# Altium project NXP_FRDM_IMX93.PrjPcb (part 1 of 13)
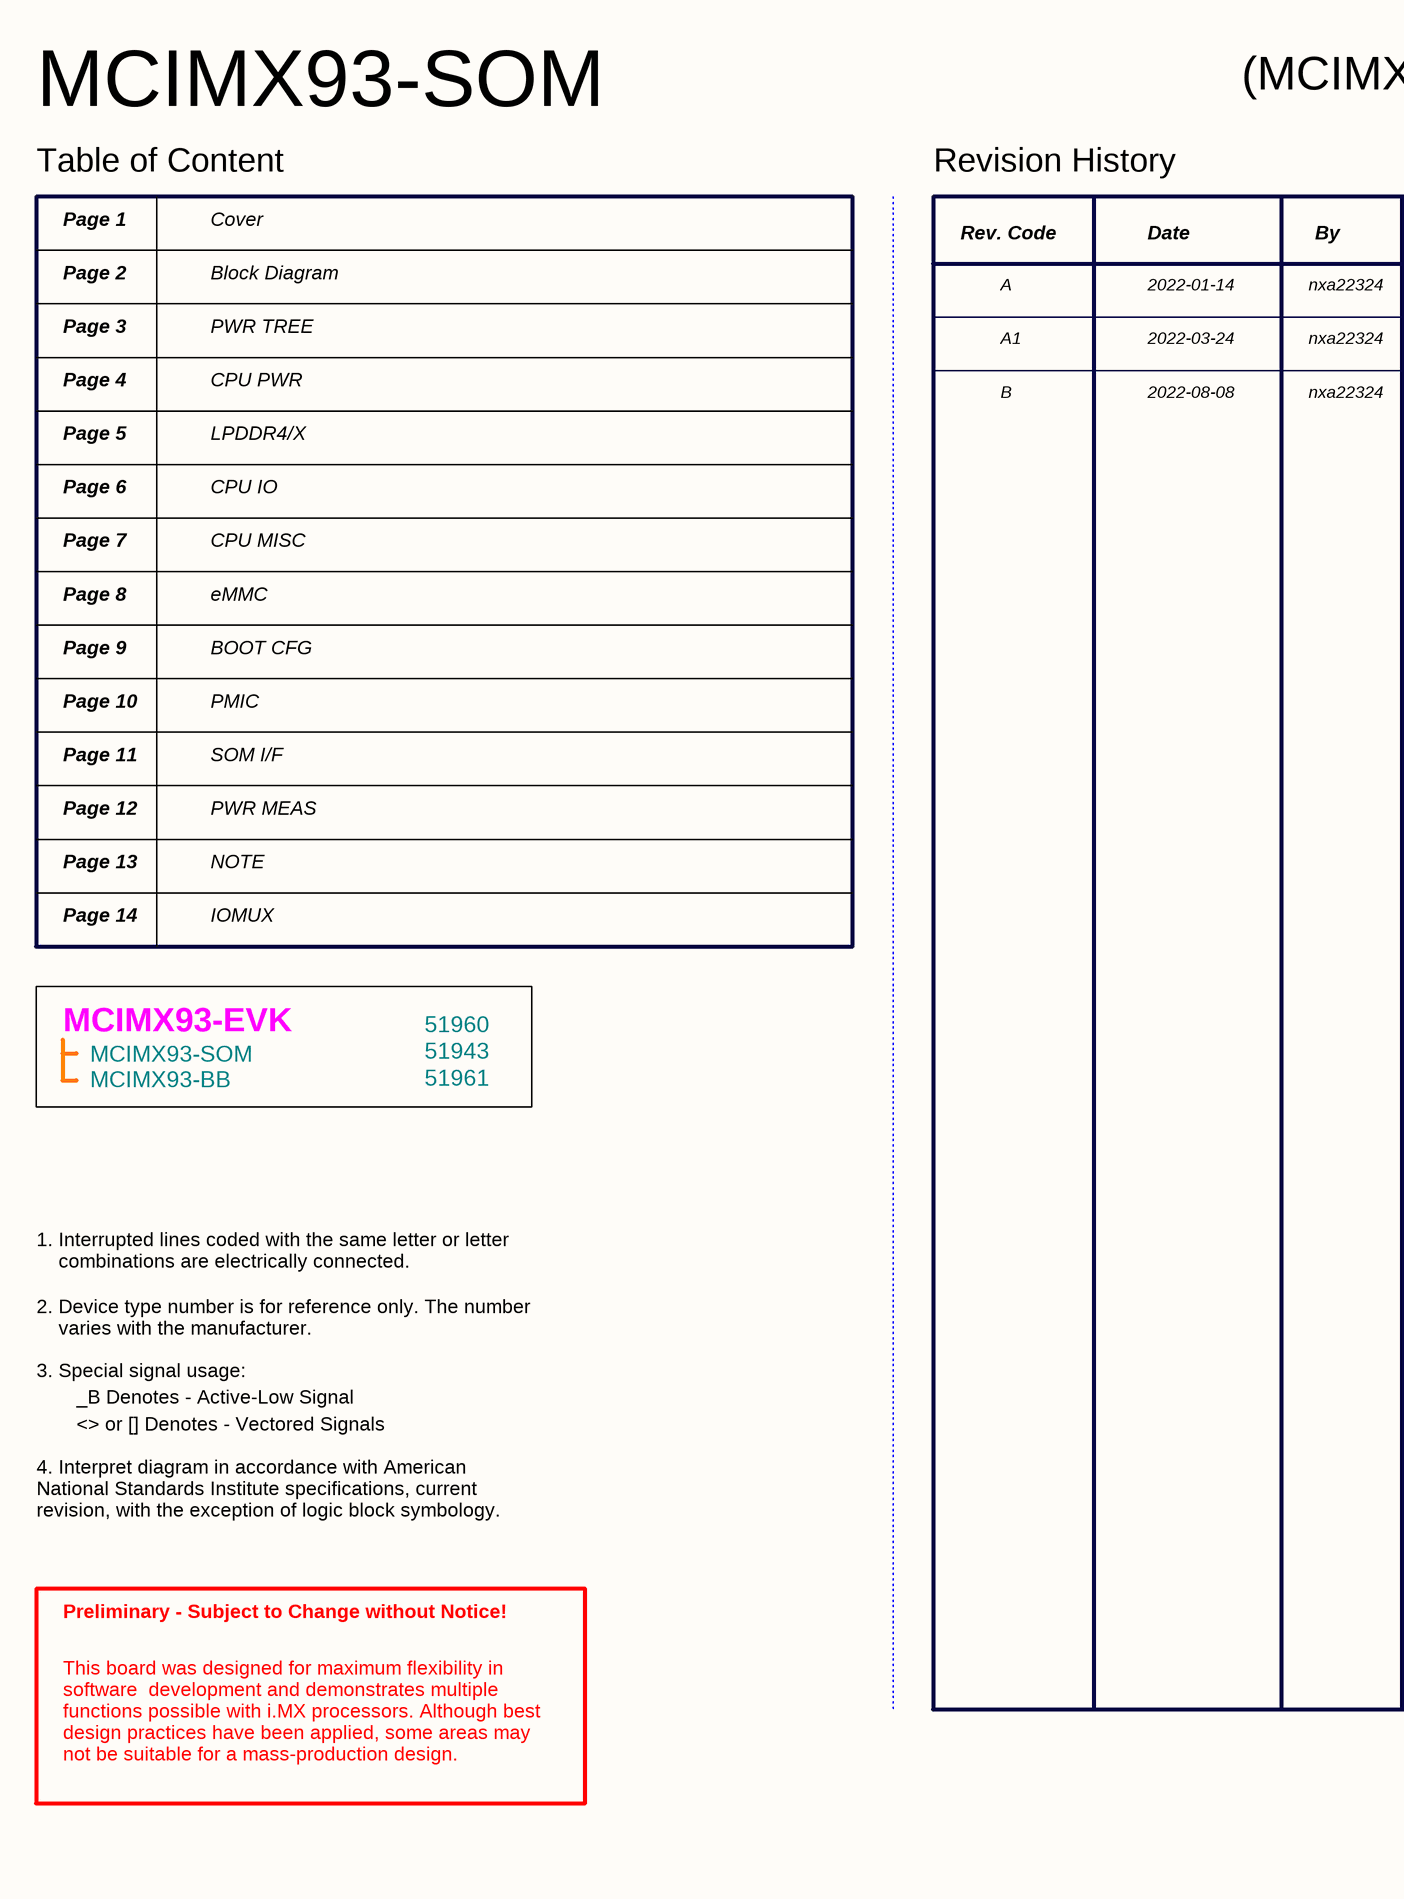
[diagram p0: A-01 COVER.SchDoc, left]
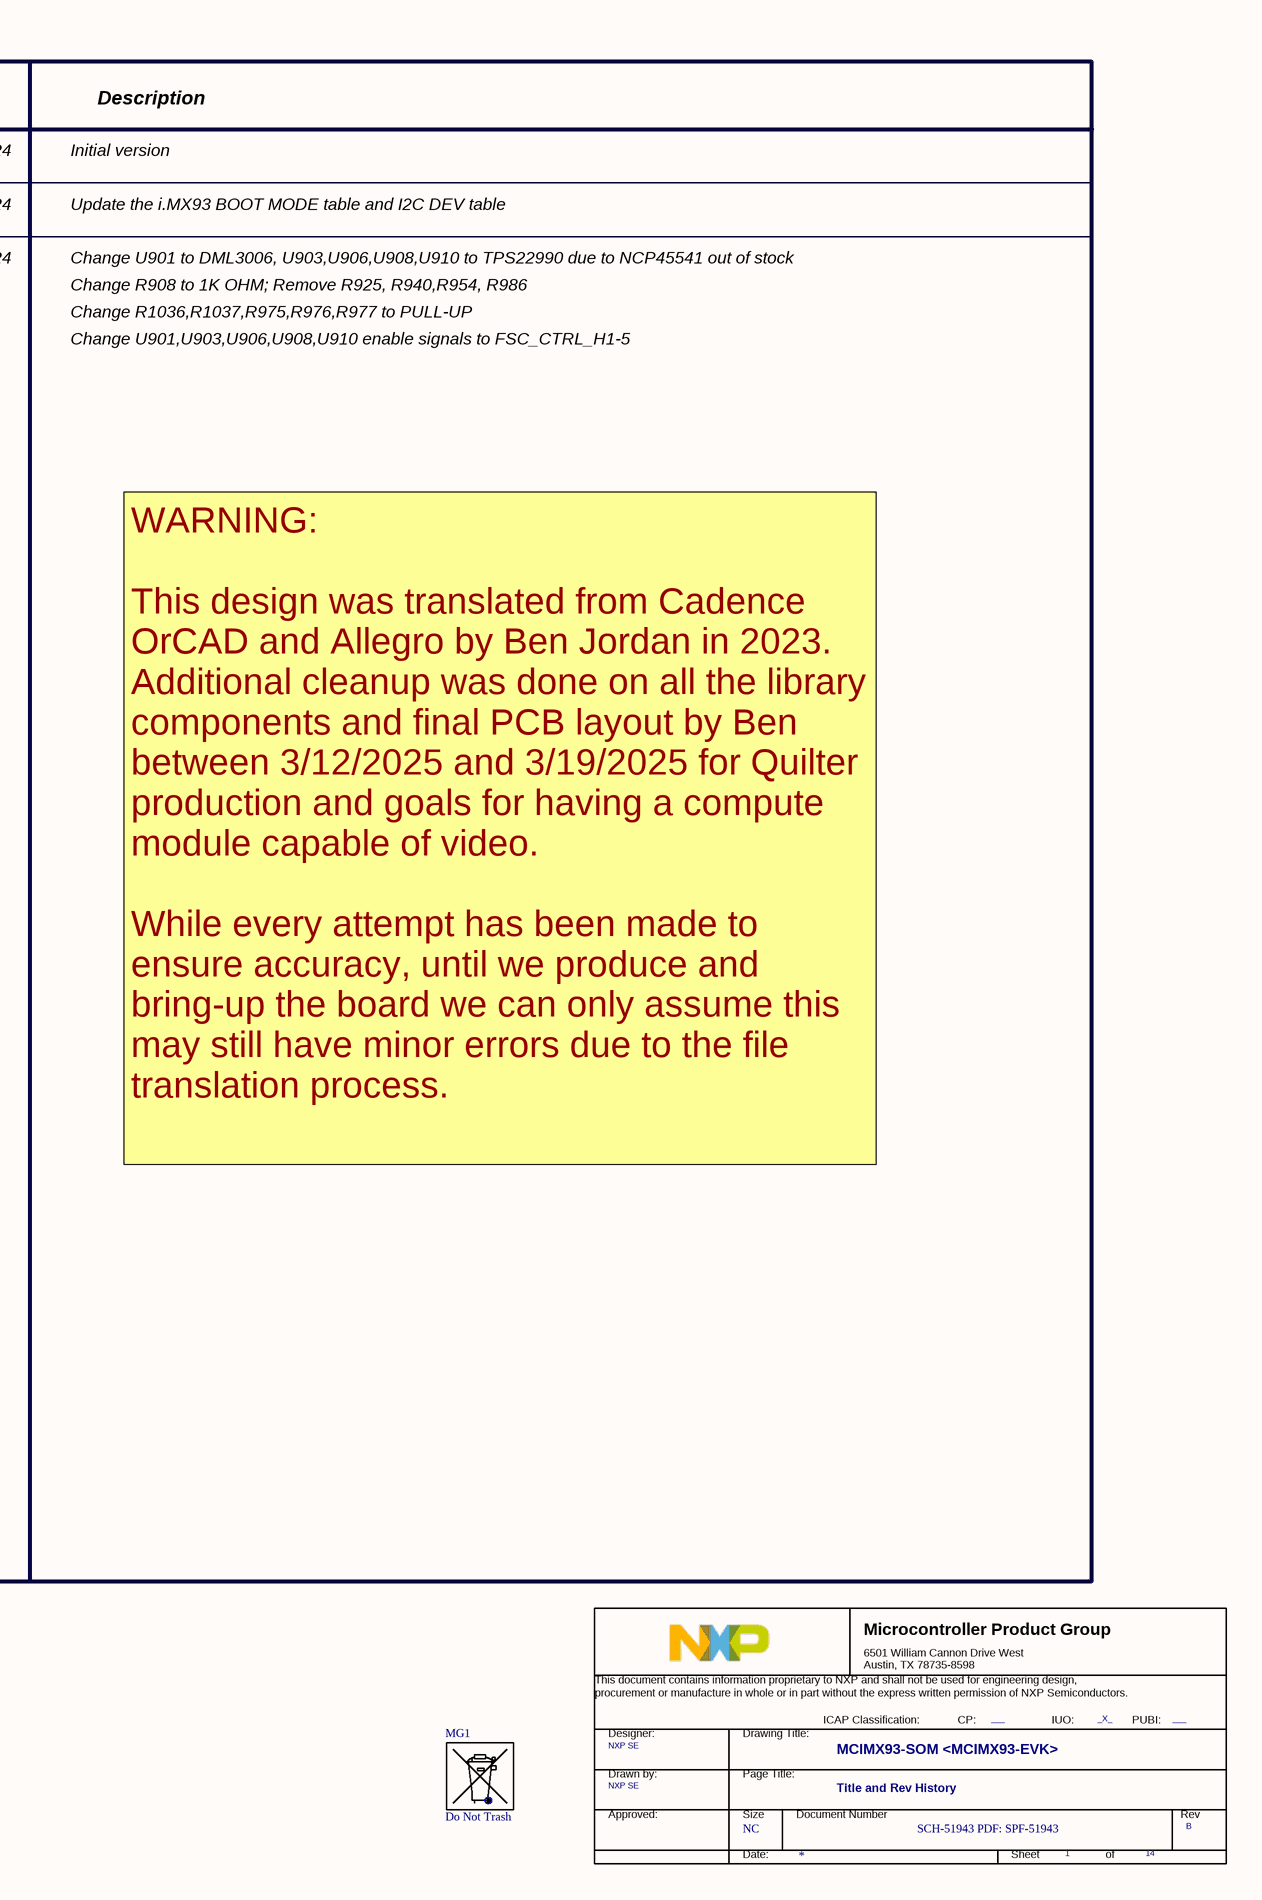
[diagram p1: A-01 COVER.SchDoc, right]
23 sheets, 1127 parts. Net scope: global (net labels, ports and power ports of the same name join across sheets).
Board file: LAY-94611_B.PcbDoc
Sheets:
  A-01 COVER.SchDoc
  A-02 BLOCK DIAGRAM.SchDoc
  A-03 PWR TREE.SchDoc
  E-04 CPU PWR.SchDoc
  E-05 LPDDR4_x.SchDoc
  E-06 CPU IO_PHY.SchDoc
  E-07 CPU MISC.SchDoc
  E-08 eMMC.SchDoc
  E-09 BOOT_CFG.SchDoc
  E-10 PMIC.SchDoc
  E-11 SYS PWR.SchDoc
  E-12 USB PD.SchDoc
  E-13 USB2 C.SchDoc
  E-14 ENET1.SchDoc
  E-15 ENET2.SchDoc
  E-16 LVDS to HDMI.SchDoc
  E-17 MIPI DSI_MIPI CSI.SchDoc
  E-18 M.2.SchDoc
  E-19 WIFI_BT_802.15.4.SchDoc
  E-20 EXP_MicroSD_ADC.SchDoc
  E-21 DEBUG_RTC_USB A_CAN.SchDoc
  X-22 NOTE.SchDoc
  X-23 IOMUX.SchDoc

## Sheet A-01 COVER.SchDoc
size 513 x 386 mm; Address1: 350W 9th Ave; Address2: Suite 206; Address3: Escondido CA 92025; Address4: United States; Revision: -; ENG_APP_DATE: --/--/--; DSN_APP_DATE: --/--/--; CHK_APP_DATE: --/--/--

### Parts
(Parts that share a designator on the sheet are numbered #1, #2 ... from top to bottom, then left to right.)
*#1  Doc: SCH-51943 PDF: SPF-51943  RevCode: B  Title: MCIMX93-SOM <MCIMX93-EVK>  Page Size: NC  Page Number: 1  Page Count: 14  PageTitle: Title and Rev History  Designer: NXP SE  PUBI: ___  FIUO: _X_  (hidden comment: TitleBlock_MCPG)  (graphical)
MG1  Do Not Trash  [ASH-BIN-V2]  (no BOM)

### Notes on the sheet
- MCIMX93-SOM
- (MCIMX93-EVK: SOM+BB)
- Table of Content
- Revision History
- Page 1
- Page 2
- Cover
- Block Diagram
- Rev. Code
- A
- Date
- 2022-01-14
- nxa22324
- By
- Initial version
- Description
- Page 3
- PWR TREE
- A1
- 2022-03-24
- Update the i.MX93 BOOT MODE table and I2C DEV table
- Page 4
- CPU PWR
- B
- 2022-08-08
- Change U901 to DML3006, U903,U906,U908,U910 to TPS22990 due to NCP45541 out of stock
- Change R908 to 1K OHM; Remove R925, R940,R954, R986
- Page 5
- LPDDR4/X
- Change R1036,R1037,R975,R976,R977 to PULL-UP
- Change U901,U903,U906,U908,U910 enable signals to FSC_CTRL_H1-5
- Page 6
- Page 7
- CPU IO
- CPU MISC
- Page 8
- eMMC
- Page 9
- BOOT CFG
- Page 10
- PMIC
- Page 11
- Page 12
- PWR MEAS
- SOM I/F
- Page 13
- NOTE
- Page 14
- IOMUX
- MCIMX93-EVK
- MCIMX93-SOM
  MCIMX93-BB
- 51961
- 51960
- 51943
- 1. Interrupted lines coded with the same letter or letter
  combinations are electrically connected.
- WARNING:
  This design was translated from Cadence OrCAD and Allegro by Ben Jordan in 2023. Additional cleanup was done on all the library components and final PCB layout by Ben between 3/12/2025 and 3/19/2025 for Quilter production and goals for having a compute module capable of video.
  While every attempt has been made to ensure accuracy, until we produce and bring-up the board we can only assume this may still have minor errors due to the file translation process.
- 2. Device type number is for reference only. The number
  varies with the manufacturer.
- 3. Special signal usage:
- _B Denotes - Active-Low Signal
- <> or [] Denotes - Vectored Signals
- 4. Interpret diagram in accordance with American
  National Standards Institute specifications, current
  revision, with the exception of logic block symbology.
- Preliminary - Subject to Change without Notice!
- This board was designed for maximum flexibility in
  software  development and demonstrates multiple
  functions possible with i.MX processors. Although best
  design practices have been applied, some areas may
  not be suitable for a mass-production design.
- 8
- 7
- 6
- 5
- 4
- 3
- 2
- 1
- REVISION
- DESCRIPTION
- DATE
- APPROVED
- F
- E
- D
- C
- PROJECT:
- REV.
- ENG:
- APPROVALS
- PROJECT
- JordanDSP LLC <https://www.jordandsp.com>
- Envision Excellence
- SHT.
- DSN:
- CHK:
- REFERENCE ITEMS
- PRJ VCS REVISION:
- TITLE
- DOC VCS REVISION:
- MODIFIED DATE:
- BOM:
- FAB DWG:
- FIRMWARE:
- ASSY DWG:
- SCALE:
- SIZE
- CAGE CODE
- FILE NAME
- DWG NO.
- PAGE
- PRODUCT REV
- OF
- (in symbol TitleBlock_MCPG) Microcontroller Product Group; 6501 William Cannon Drive West / Austin, TX 78735-8598; This document contains information proprietary to NXP and shall not be used for engineering design,; procurement or manufacture in whole or in part without the express written permission of NXP Semiconductors.; ICAP Classification:; CP:; IUO:; PUBI:; Designer:; Drawing Title:; Drawn by:; Page Title:; Approved:; Size; Document Number; Rev; Date:; Sheet; of

### Library data of the parts
*#1 = TitleBlock_MCPG: OrgName: NXP Semiconductor; OrgAddr1: NO. 192 Liangjing Rd. Pudong New Area, ShangHai; Page Create Date: March  8, 1995; DrawnBy: NXP SE; FCP: ___; Page Modify Date: *
MG1 = CMP-00053-1: PCB Graphic Symbol - Do Not Dispose Of In Garbage (Environmental Symbol)

## Sheet A-02 BLOCK DIAGRAM.SchDoc
size 513 x 386 mm; Address1: 350W 9th Ave; Address2: Suite 206; Address3: Escondido CA 92025; Address4: United States; Revision: -; ENG_APP_DATE: --/--/--; DSN_APP_DATE: --/--/--; CHK_APP_DATE: --/--/--
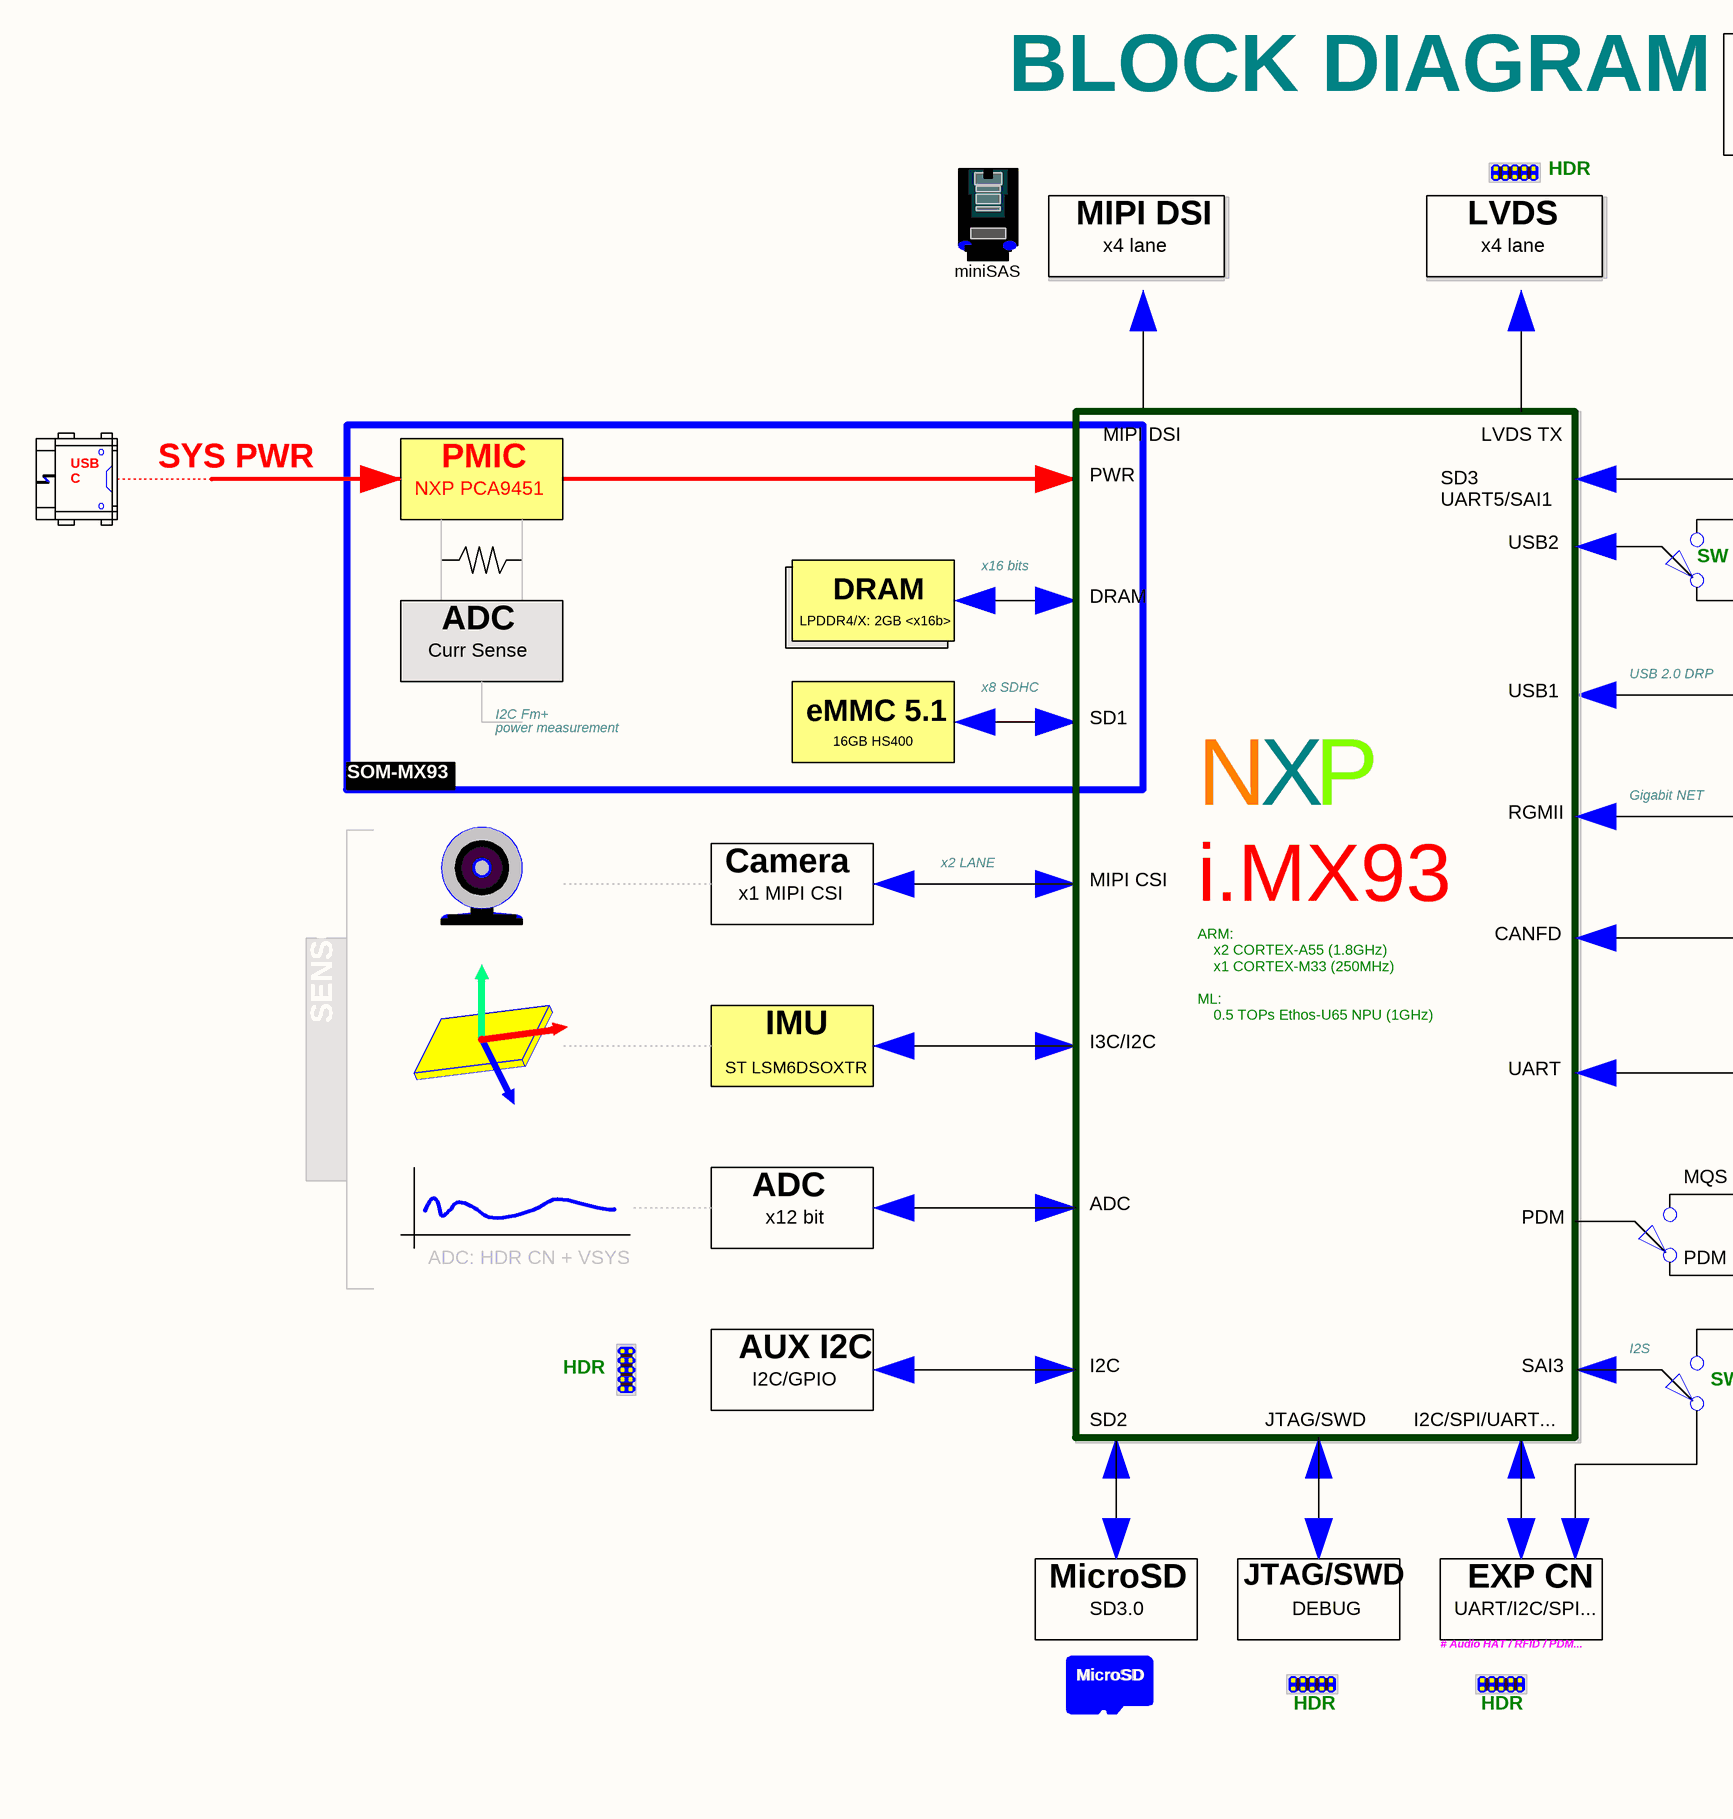
[diagram p2: A-02 BLOCK DIAGRAM.SchDoc, left]
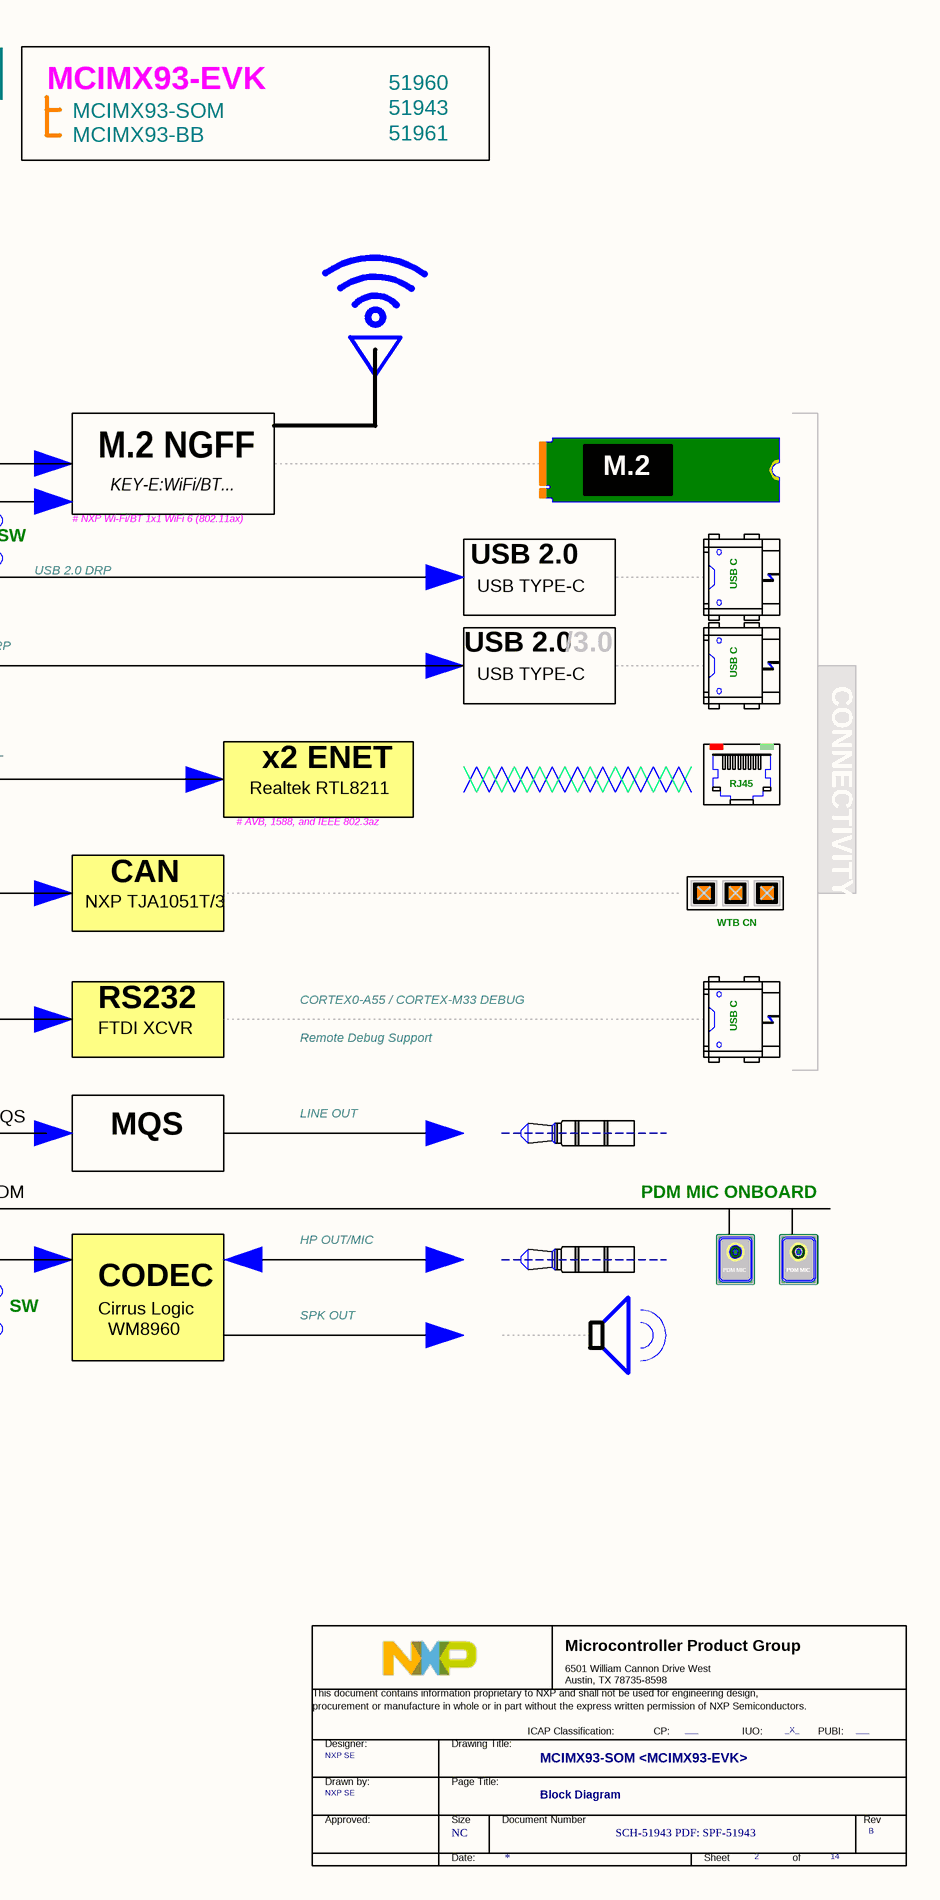
[diagram p3: A-02 BLOCK DIAGRAM.SchDoc, right]

### Parts
(Parts that share a designator on the sheet are numbered #1, #2 ... from top to bottom, then left to right.)
*#2  Doc: SCH-51943 PDF: SPF-51943  RevCode: B  Title: MCIMX93-SOM <MCIMX93-EVK>  Page Size: NC  Page Number: 2  Page Count: 14  PageTitle: Block Diagram  Designer: NXP SE  PUBI: ___  FIUO: _X_  (hidden comment: TitleBlock_MCPG)  (graphical)

### Notes on the sheet
- BLOCK DIAGRAM
- MCIMX93-EVK
- 51943
- 51960
- HDR
- MCIMX93-SOM
  MCIMX93-BB
- 51961
- MIPI DSI
- x4 lane
- LVDS
- miniSAS
- LVDS TX
- USB C
  PD
- SYS PWR
- NXP PCA9451
- PMIC
- PWR
- SD3
  UART5/SAI1
- M.2 NGFF
- KEY-E:WiFi/BT...
- M.2
- x16 bits
- USB2
- SW
- USB 2.0 DRP
- # NXP Wi-Fi/BT 1x1 WiFi 6 (802.11ax)
- USB 2.0
- Curr Sense
- ADC
- LPDDR4/X: 2GB <x16b>
- DRAM
- USB TYPE-C
- USB C
- I2C Fm+
- power measurement
- eMMC 5.1
- x8 SDHC
- SD1
- USB1
- /3.0
- CONNECTIVITY
- SOM-MX93
- 16GB HS400
- Gigabit NET
- x2 LANE
- N
- X
- P
- RGMII
- # AVB, 1588, and IEEE 802.3az
- Realtek RTL8211
- x2 ENET
- RJ45
- Camera
- x1 MIPI CSI
- MIPI CSI
- i.MX93
- CAN
- CANFD
- NXP TJA1051T/3
- WTB CN
- SENSOR
- ST LSM6DSOXTR
- IMU
- I3C/I2C
- ARM:
  x2 CORTEX-A55 (1.8GHz)
  x1 CORTEX-M33 (250MHz)
  ML:
  0.5 TOPs Ethos-U65 NPU (1GHz)
- RS232
- CORTEX0-A55 / CORTEX-M33 DEBUG
- UART
- FTDI XCVR
- Remote Debug Support
- MQS
- LINE OUT
- ADC: HDR CN + VSYS
- x12 bit
- PDM
- PDM MIC ONBOARD
- HP OUT/MIC
- PDM MIC
- AUX I2C
- I2C/GPIO
- I2C
- SAI3
- I2S
- Cirrus Logic
  WM8960
- CODEC
- SPK OUT
- SD2
- JTAG/SWD
- I2C/SPI/UART...
- MicroSD
- EXP CN
- SD3.0
- DEBUG
- # Audio HAT / RFID / PDM...
- UART/I2C/SPI...
- 8
- 7
- 6
- 5
- 4
- 3
- 2
- 1
- REVISION
- DESCRIPTION
- DATE
- APPROVED
- F
- E
- D
- C
- B
- PROJECT:
- REV.
- ENG:
- APPROVALS
- PROJECT
- JordanDSP LLC <https://www.jordandsp.com>
- Envision Excellence
- SHT.
- A
- DSN:
- CHK:
- REFERENCE ITEMS
- PRJ VCS REVISION:
- TITLE
- DOC VCS REVISION:
- MODIFIED DATE:
- BOM:
- FAB DWG:
- FIRMWARE:
- ASSY DWG:
- SCALE:
- SIZE
- CAGE CODE
- FILE NAME
- DWG NO.
- PAGE
- PRODUCT REV
- OF
- (in symbol TitleBlock_MCPG) Microcontroller Product Group; 6501 William Cannon Drive West / Austin, TX 78735-8598; This document contains information proprietary to NXP and shall not be used for engineering design,; procurement or manufacture in whole or in part without the express written permission of NXP Semiconductors.; ICAP Classification:; CP:; IUO:; PUBI:; Designer:; Drawing Title:; Drawn by:; Page Title:; Approved:; Size; Document Number; Rev; Date:; Sheet; of

### Library data of the parts
*#2 = TitleBlock_MCPG: OrgAddr1: NO. 192 Liangjing Rd. Pudong New Area, ShangHai; OrgName: NXP Semiconductor; Page Create Date: March  8, 1995; DrawnBy: NXP SE; FCP: ___; Page Modify Date: *

## Sheet A-03 PWR TREE.SchDoc
size 614 x 462 mm; Address1: 350W 9th Ave; Address2: Suite 206; Address3: Escondido CA 92025; Address4: United States; Revision: -; ENG_APP_DATE: --/--/--; DSN_APP_DATE: --/--/--; CHK_APP_DATE: --/--/--
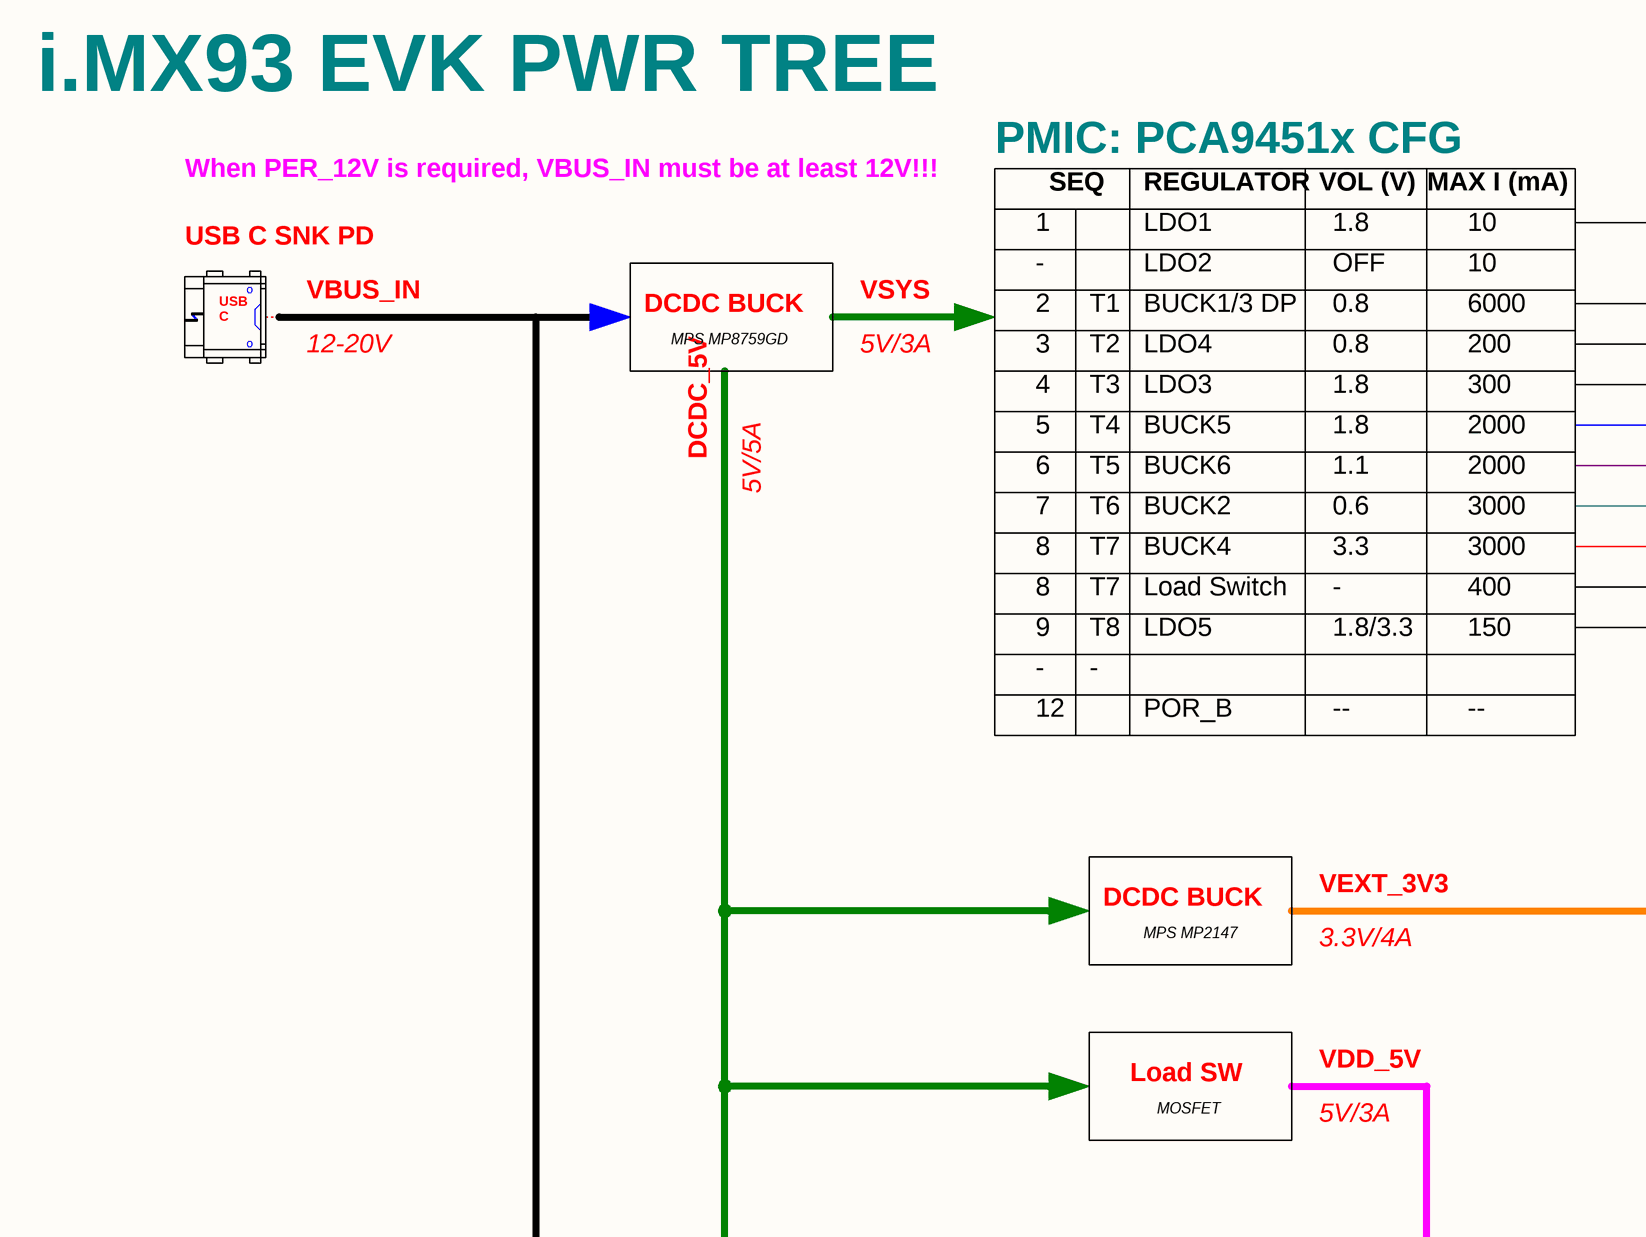
[diagram p4: A-03 PWR TREE.SchDoc, top left]
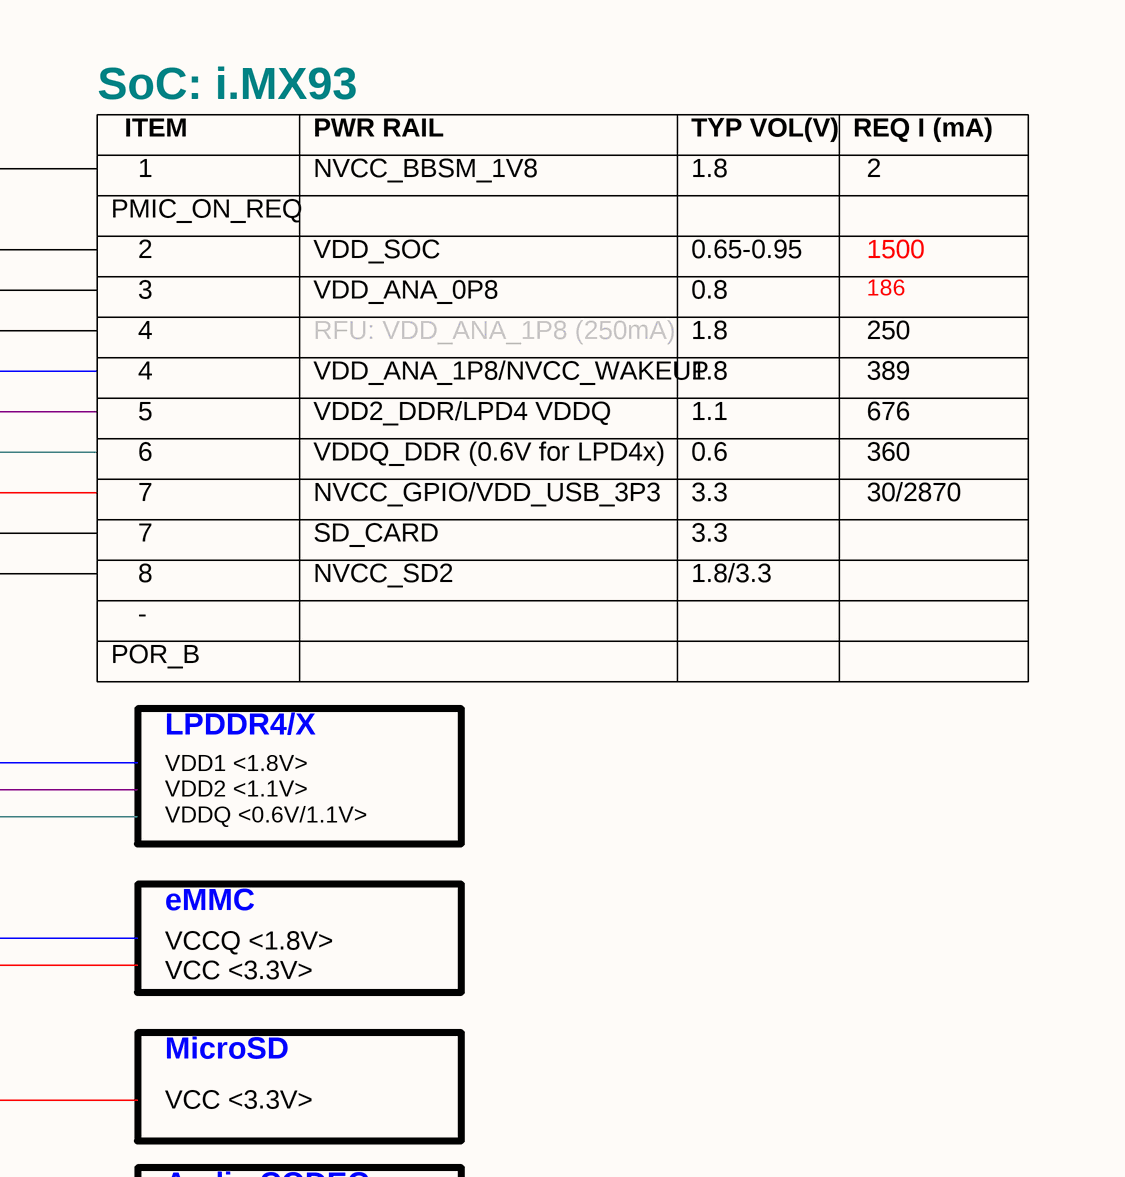
[diagram p5: A-03 PWR TREE.SchDoc, top right]
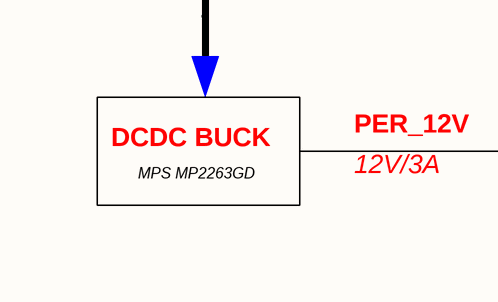
[diagram p6: A-03 PWR TREE.SchDoc, bottom left]
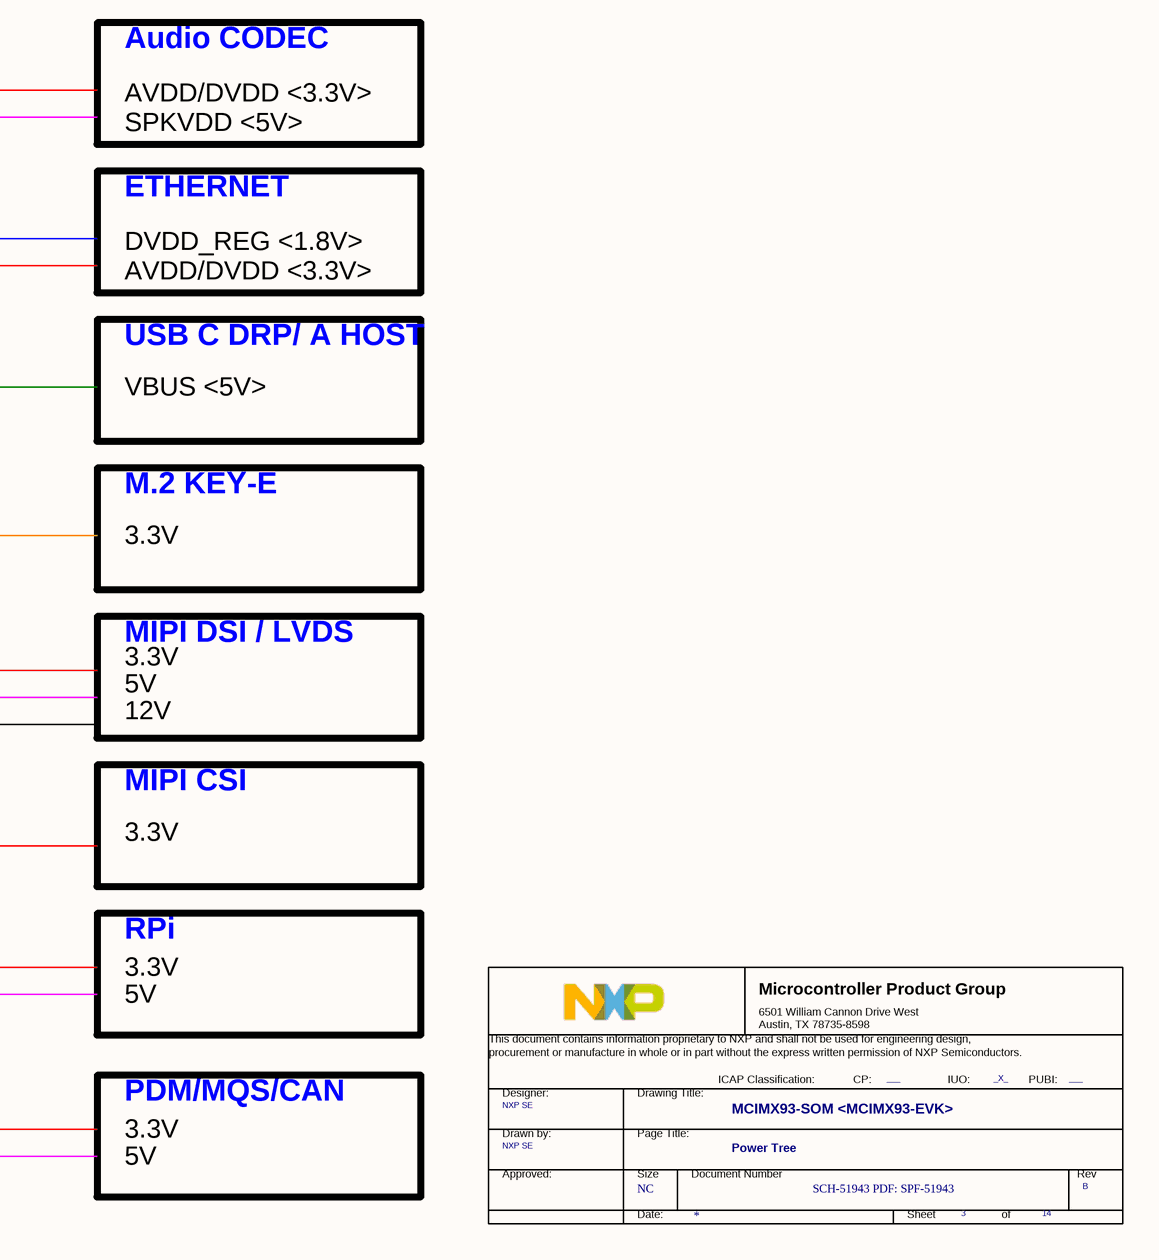
[diagram p7: A-03 PWR TREE.SchDoc, bottom right]

### Parts
(Parts that share a designator on the sheet are numbered #1, #2 ... from top to bottom, then left to right.)
*#3  Doc: SCH-51943 PDF: SPF-51943  RevCode: B  Title: MCIMX93-SOM <MCIMX93-EVK>  Page Size: NC  Page Number: 3  Page Count: 14  PageTitle: Power Tree  Designer: NXP SE  PUBI: ___  FIUO: _X_  (hidden comment: TitleBlock_MCPG)  (graphical)

### Notes on the sheet
- i.MX93 EVK PWR TREE
- PMIC: PCA9451x CFG
- SoC: i.MX93
- When PER_12V is required, VBUS_IN must be at least 12V!!!
- 1
- SEQ
- REGULATOR
- LDO1
- VOL (V)
- 1.8
- MAX I (mA)
- 10
- ITEM
- PWR RAIL
- NVCC_BBSM_1V8
- TYP VOL(V)
- REQ I (mA)
- 2
- USB C SNK PD
- VBUS_IN
- VSYS
- -
- LDO2
- OFF
- PMIC_ON_REQ
- USB C
  PD
- 12-20V
- DCDC BUCK
- MPS MP8759GD
- 5V/3A
- 3
- T2
- T1
- BUCK1/3 DP
- LDO4
- 0.8
- 6000
- 200
- VDD_SOC
- VDD_ANA_0P8
- 0.65-0.95
- 1500
- 186
- 4
- 5
- T4
- T3
- LDO3
- BUCK5
- 2000
- 300
- VDD_ANA_1P8/NVCC_WAKEUP
- RFU: VDD_ANA_1P8 (250mA)
- 389
- 250
- DCDC_5V
- 5V/5A
- 6
- T5
- BUCK6
- 1.1
- VDD2_DDR/LPD4 VDDQ
- 676
- 8
- 7
- T7
- T6
- BUCK2
- BUCK4
- 3.3
- 0.6
- 3000
- VDDQ_DDR (0.6V for LPD4x)
- NVCC_GPIO/VDD_USB_3P3
- 30/2870
- 360
- 9
- T8
- Load Switch
- LDO5
- 1.8/3.3
- 400
- 150
- SD_CARD
- NVCC_SD2
- 12
- POR_B
- --
- LPDDR4/X
- VEXT_3V3
- VDD1 <1.8V>
  VDD2 <1.1V>
  VDDQ <0.6V/1.1V>
- MPS MP2147
- 3.3V/4A
- eMMC
- VCCQ <1.8V>
  VCC <3.3V>
- Load SW
- MOSFET
- VDD_5V
- MicroSD
- VCC <3.3V>
- Audio CODEC
- AVDD/DVDD <3.3V>
  SPKVDD <5V>
- ETHERNET
- DVDD_REG <1.8V>
  AVDD/DVDD <3.3V>
- USB C DRP/ A HOST
- VBUS <5V>
- M.2 KEY-E
- 3.3V
- MIPI DSI / LVDS
- PER_12V
- 12V
- 5V
- MPS MP2263GD
- 12V/3A
- MIPI CSI
- RPi
- PDM/MQS/CAN
- REVISION
- DESCRIPTION
- DATE
- APPROVED
- F
- E
- D
- C
- B
- PROJECT:
- REV.
- ENG:
- APPROVALS
- PROJECT
- JordanDSP LLC <https://www.jordandsp.com>
- Envision Excellence
- SHT.
- A
- DSN:
- CHK:
- REFERENCE ITEMS
- PRJ VCS REVISION:
- TITLE
- DOC VCS REVISION:
- MODIFIED DATE:
- BOM:
- FAB DWG:
- FIRMWARE:
- ASSY DWG:
- SCALE:
- SIZE
- CAGE CODE
- FILE NAME
- DWG NO.
- PAGE
- PRODUCT REV
- OF
- (in symbol TitleBlock_MCPG) Microcontroller Product Group; 6501 William Cannon Drive West / Austin, TX 78735-8598; This document contains information proprietary to NXP and shall not be used for engineering design,; procurement or manufacture in whole or in part without the express written permission of NXP Semiconductors.; ICAP Classification:; CP:; IUO:; PUBI:; Designer:; Drawing Title:; Drawn by:; Page Title:; Approved:; Size; Document Number; Rev; Date:; Sheet; of

### Library data of the parts
*#3 = TitleBlock_MCPG: as *#2 on sheet A-02 BLOCK DIAGRAM; Page Create Date: March  8, 1995; DrawnBy: NXP SE; FCP: ___; Page Modify Date: *

## Sheet E-04 CPU PWR.SchDoc: FRDM-IMX93
size 513 x 386 mm; DrawnBy: FORLINX; Organization: ORGANIZATION; Address1: ADDRESS 1; Address2: ADDRESS 2; Address3: ADDRESS 3; Address4: ADDRESS 4; Revision: -; ENG_APP_DATE: --/--/--; DSN_APP_DATE: --/--/--; CHK_APP_DATE: --/--/--; Classification: Public, Company Internal/Proprietary, Company Confidential,  Company Secret; Page Create Date: March  8, 1995; OrgName: NXP Semiconductor; FIUO: A; OrgAddr1: NO. 192 Liangjing Rd. Pudong New Area, ShangHai; Page Number: 4; PageTitle: CPU PWR; Page Size: C; Page Count: 23; Designer: FORLINX; RevCode: B1; Approver: NXP SE; Doc: SCH-94611 PDF: SPF-94611; DsnPath: T:\FILES\Designs\Single Board Computers\i.MX93-FRDM\Design Files\SCH-94611_B1.DSN; SchematicName: FRDM-i.MX 93 Development Board; PageName: E-04 CPU PWR; PageSize: C; TopSchematic: True
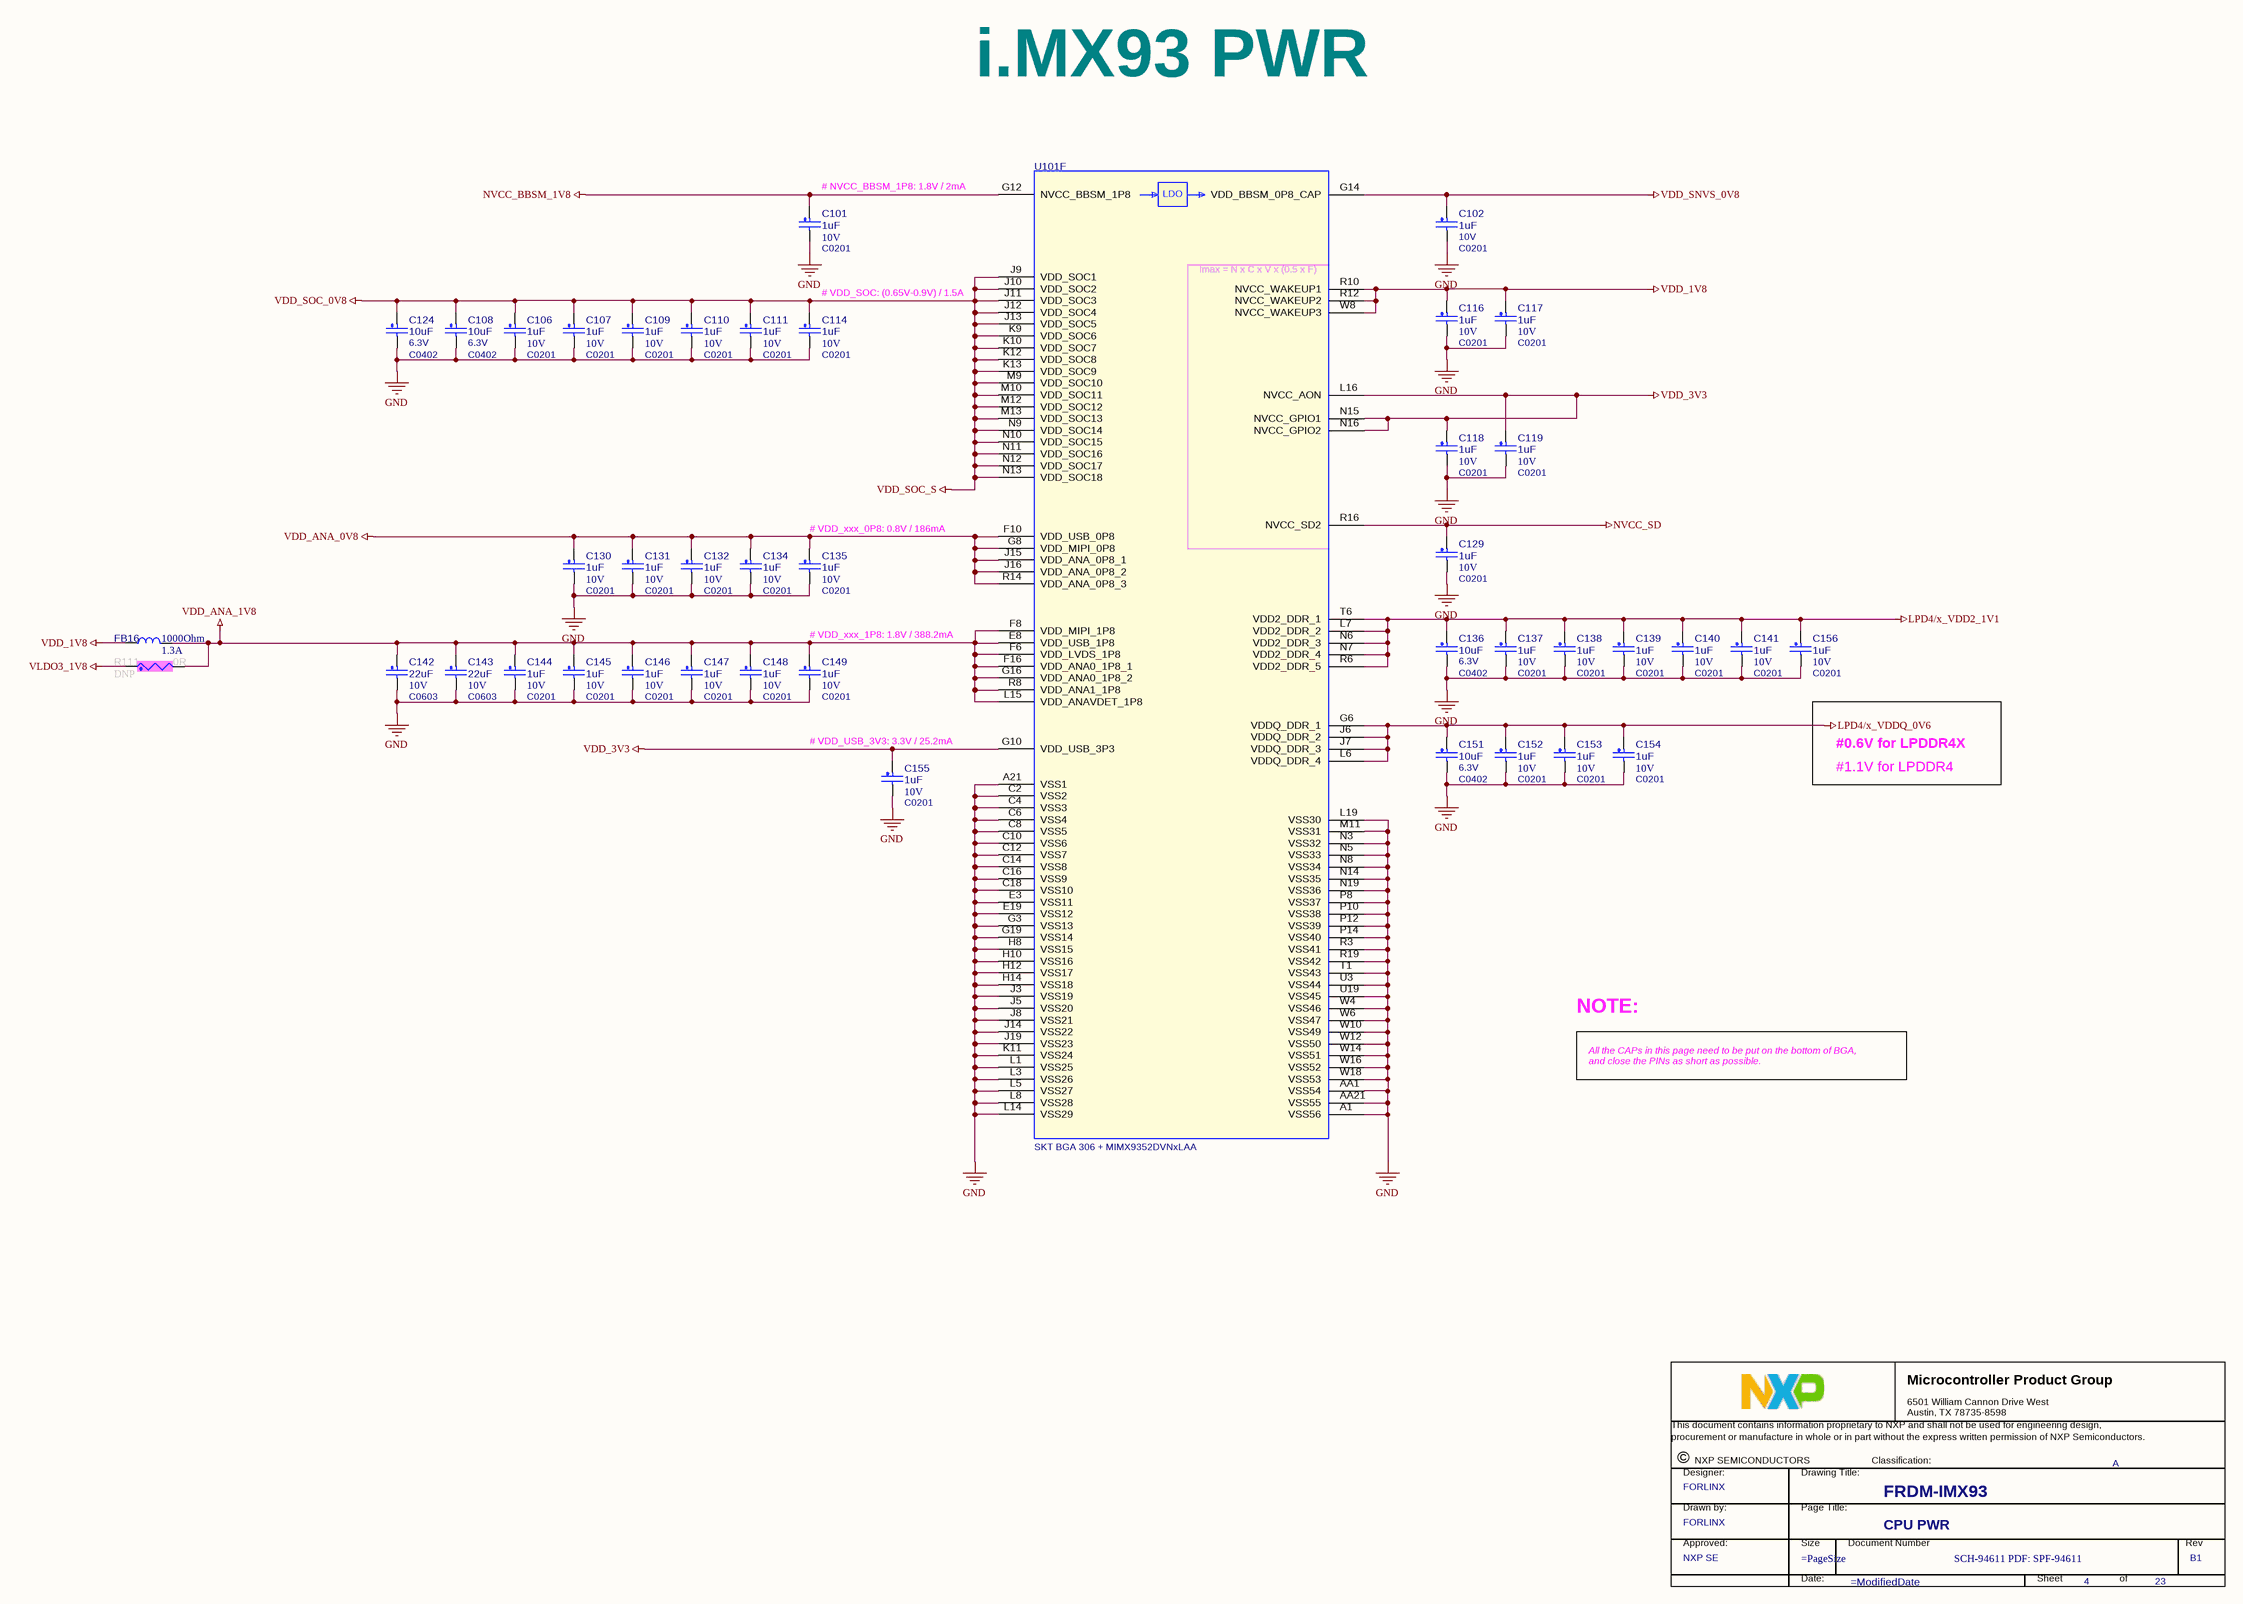
[diagram p8: E-04 CPU PWR.SchDoc]

### Parts
(Parts that share a designator on the sheet are numbered #1, #2 ... from top to bottom, then left to right.)
*#4  Title: FRDM-IMX93  RevCode: B1  PageTitle: CPU PWR  Page Number: 4  Page Count: 23  DrawnBy: FORLINX  Doc: SCH-94611 PDF: SPF-94611  Approver: NXP SE  FIUO: A  (graphical)
C101  1uF  VOLTAGE: 10V  [C0201]
C102  1uF  VOLTAGE: 10V  [C0201]
C106  1uF  VOLTAGE: 10V  [C0201]
C107  1uF  VOLTAGE: 10V  [C0201]
C108  10uF  VOLTAGE: 6.3V  [C0402]
C109  1uF  VOLTAGE: 10V  [C0201]
C110  1uF  VOLTAGE: 10V  [C0201]
C111  1uF  VOLTAGE: 10V  [C0201]
C114  1uF  VOLTAGE: 10V  [C0201]
C116  1uF  VOLTAGE: 10V  [C0201]
C117  1uF  VOLTAGE: 10V  [C0201]
C118  1uF  VOLTAGE: 10V  [C0201]
C119  1uF  VOLTAGE: 10V  [C0201]
C124  10uF  VOLTAGE: 6.3V  [C0402]
C129  1uF  VOLTAGE: 10V  [C0201]
C130  1uF  VOLTAGE: 10V  [C0201]
C131  1uF  VOLTAGE: 10V  [C0201]
C132  1uF  VOLTAGE: 10V  [C0201]
C134  1uF  VOLTAGE: 10V  [C0201]
C135  1uF  VOLTAGE: 10V  [C0201]
C136  10uF  VOLTAGE: 6.3V  [C0402]
C137  1uF  VOLTAGE: 10V  [C0201]
C138  1uF  VOLTAGE: 10V  [C0201]
C139  1uF  VOLTAGE: 10V  [C0201]
C140  1uF  VOLTAGE: 10V  [C0201]
C141  1uF  VOLTAGE: 10V  [C0201]
C142  22uF  VOLTAGE: 10V  [C0603]
C143  22uF  VOLTAGE: 10V  [C0603]
C144  1uF  VOLTAGE: 10V  [C0201]
C145  1uF  VOLTAGE: 10V  [C0201]
C146  1uF  VOLTAGE: 10V  [C0201]
C147  1uF  VOLTAGE: 10V  [C0201]
C148  1uF  VOLTAGE: 10V  [C0201]
C149  1uF  VOLTAGE: 10V  [C0201]
C151  10uF  VOLTAGE: 6.3V  [C0402]
C152  1uF  VOLTAGE: 10V  [C0201]
C153  1uF  VOLTAGE: 10V  [C0201]
C154  1uF  VOLTAGE: 10V  [C0201]
C155  1uF  VOLTAGE: 10V  [C0201]
C156  1uF  VOLTAGE: 10V  [C0201]
FB16  1000Ohm  electric current: 1.3A  [FB0603]
R111  0R  ASSY_OPT: DNP  [R0603]
U101  SKT BGA 306 + MIMX9352DVNxLAA  [skt_bga306_0p5_sq16p23_elast_nsp]  (part F of 6)

### Nets
GND: C101.2 C102.2 C106.2 C107.2 C108.2 C109.2 C110.2 C111.2 C114.2 C116.2 C117.2 C118.2 C119.2 C124.2 C129.2 C130.2 C131.2 C132.2 C134.2 C135.2 C136.2 C137.2 C138.2 C139.2 C140.2 C141.2 C142.2 C143.2 C144.2 C145.2 C146.2 C147.2 C148.2 C149.2 C151.2 C152.2 C153.2 C154.2 C155.2 C156.2 U101.A1(VSS56) U101.A21(VSS1) U101.AA1(VSS54) U101.AA21(VSS55) U101.C2(VSS2) U101.C4(VSS3) U101.C6(VSS4) U101.C8(VSS5) U101.C10(VSS6) U101.C12(VSS7) U101.C14(VSS8) U101.C16(VSS9) U101.C18(VSS10) U101.E3(VSS11) U101.E19(VSS12) U101.G3(VSS13) U101.G19(VSS14) U101.H8(VSS15) U101.H10(VSS16) U101.H12(VSS17) U101.H14(VSS18) U101.J3(VSS19) U101.J5(VSS20) U101.J8(VSS21) U101.J14(VSS22) U101.J19(VSS23) U101.K11(VSS24) U101.L1(VSS25) U101.L3(VSS26) U101.L5(VSS27) U101.L8(VSS28) U101.L14(VSS29) U101.L19(VSS30) U101.M11(VSS31) U101.N3(VSS32) U101.N5(VSS33) U101.N8(VSS34) U101.N14(VSS35) U101.N19(VSS36) U101.P8(VSS37) U101.P10(VSS38) U101.P12(VSS39) U101.P14(VSS40) U101.R3(VSS41) U101.R19(VSS42) U101.T1(VSS43) U101.U3(VSS44) U101.U19(VSS45) U101.W4(VSS46) U101.W6(VSS47) U101.W10(VSS49) U101.W12(VSS50) U101.W14(VSS51) U101.W16(VSS52) U101.W18(VSS53)
LPD4/x_VDD2_1V1: C136.1 C137.1 C138.1 C139.1 C140.1 C141.1 C156.1 U101.L7(VDD2_DDR_2) U101.N6(VDD2_DDR_3) U101.N7(VDD2_DDR_4) U101.R6(VDD2_DDR_5) U101.T6(VDD2_DDR_1)  [project net LPD4/x_VDD2]
LPD4/x_VDDQ_0V6: C151.1 C152.1 C153.1 C154.1 U101.G6(VDDQ_DDR_1) U101.J6(VDDQ_DDR_2) U101.J7(VDDQ_DDR_3) U101.L6(VDDQ_DDR_4)  [project net LPD4/x_VDDQ]
NVCC_BBSM_1V8: C101.1 U101.G12(NVCC_BBSM_1P8)
NVCC_SD: C129.1 U101.R16(NVCC_SD2)
VDD_1V8: C116.1 C117.1 FB16.1 U101.R10(NVCC_WAKEUP1) U101.R12(NVCC_WAKEUP2) U101.W8(NVCC_WAKEUP3)  [project net LPD4/x_VDD1]
VDD_3V3: C118.1 C119.1 C155.1 U101.G10(VDD_USB_3P3) U101.L16(NVCC_AON) U101.N15(NVCC_GPIO1) U101.N16(NVCC_GPIO2)
VDD_ANA_0V8: C130.1 C131.1 C132.1 C134.1 C135.1 U101.F10(VDD_USB_0P8) U101.G8(VDD_MIPI_0P8) U101.J15(VDD_ANA_0P8_1) U101.J16(VDD_ANA_0P8_2) U101.R14(VDD_ANA_0P8_3)
VDD_ANA_1V8: C142.1 C143.1 C144.1 C145.1 C146.1 C147.1 C148.1 C149.1 FB16.2 R111.2 U101.E8(VDD_USB_1P8) U101.F6(VDD_LVDS_1P8) U101.F8(VDD_MIPI_1P8) U101.F16(VDD_ANA0_1P8_1) U101.G16(VDD_ANA0_1P8_2) U101.L15(VDD_ANAVDET_1P8) U101.R8(VDD_ANA1_1P8)
VDD_SNVS_0V8: C102.1 U101.G14(VDD_BBSM_0P8_CAP)
VDD_SOC_0V8: C106.1 C107.1 C108.1 C109.1 C110.1 C111.1 C114.1 C124.1 U101.J9(VDD_SOC1) U101.J10(VDD_SOC2) U101.J11(VDD_SOC3) U101.J12(VDD_SOC4) U101.J13(VDD_SOC5) U101.K9(VDD_SOC6) U101.K10(VDD_SOC7) U101.K12(VDD_SOC8) U101.K13(VDD_SOC9) U101.M9(VDD_SOC10) U101.M10(VDD_SOC11) U101.M12(VDD_SOC12) U101.M13(VDD_SOC13) U101.N9(VDD_SOC14) U101.N10(VDD_SOC15) U101.N11(VDD_SOC16) U101.N12(VDD_SOC17) U101.N13(VDD_SOC18)  [also labelled VDD_SOC_S]
VLDO3_1V8: R111.1

### Notes on the sheet
- i.MX93 PWR
- (near C101) # NVCC_BBSM_1P8: 1.8V / 2mA
- (near C114) # VDD_SOC: (0.65V-0.9V) / 1.5A
- (near U101) Imax = N x C x V x (0.5 x F)
- (near C135) # VDD_xxx_0P8: 0.8V / 186mA
- (near C149) # VDD_xxx_1P8: 1.8V / 388.2mA
- (near C155) # VDD_USB_3V3: 3.3V / 25.2mA
- #1.1V for LPDDR4
- #0.6V for LPDDR4X
- NOTE:
- All the CAPs in this page need to be put on the bottom of BGA,
  and close the PINs as short as possible.
- DWG. NO.
- REV.
- SHT.
- REVISION
- DESCRIPTION
- DATE
- APPROVED
- ENG:
- APPROVALS
- quilter.ai <http://quilter.ai>
- DSN:
- CHK:
- REFERENCE DOCUMENTS
- TITLE
- PROJECT
- BOM:
- FAB DWG:
- PCB DWG:
- ASSY DWG:
- SIZE
- FILE NAME
- C
- DWG NO.
- SHEET
- OF
- REV
- (in symbol MIMX9352DVNxLAA, part F) LDO
- (in symbol TitleBlock_MCPG) Microcontroller Product Group; 6501 William Cannon Drive West / Austin, TX 78735-8598; This document contains information proprietary to NXP and shall not be used for engineering design,; procurement or manufacture in whole or in part without the express written permission of NXP Semiconductors.; ©; NXP SEMICONDUCTORS; Classification:; Designer:; Drawing Title:; Drawn by:; Page Title:; Approved:; Size; Document Number; Rev; Date:; Sheet; of

### Library data of the parts
*#4 = TitleBlock_MCPG: Classification: Public, Company Internal/Proprietary, Company Confidential,  Company Secret; OrgAddr1: NO. 192 Liangjing Rd. Pudong New Area, ShangHai; OrgName: NXP Semiconductor; Page Size: =PageSize; Page Create Date: March  8, 1995; Designer: FORLINX; Page Modify Date: =ModifiedDate
C101 = CAP_NP: 0201,1uF,10V,+/-20%,X5R; Part Reference: C101; CLASS: DISCRETE; Temp Range: -55¡ãC to 85¡ãC; FPLIST: CC0201,CC0201_HD,0201_CC,cc_0201_cir; CAD_APPROVED: Yes; MFG_PN01: CL03A105MP3NSNC; MFG_NAME01: SAMSUNG; Tolerance: 10%; Value: 1uF; HEIGHT: 0.35MM; ROHS: Yes; Package Size: 0201 (0603 Metric); Package Type: SMD/SMT; PCB Footprint: C0201
C102 = CAP_NP: 0201,1uF,10V,+/-20%,X5R; Part Reference: C102; CLASS: DISCRETE; FPLIST: CC0201,CC0201_HD,0201_CC; CAD_APPROVED: Yes; MFG_PN01: CL03A105MP3NSNC; MFG_NAME01: SAMSUNG; Tolerance: 20%; Value: 1uF; HEIGHT: 0.33MM; ROHS: Yes; PCB Footprint: C0201
C106 = CAP_NP: 0201,1uF,10V,+/-20%,X5R; Part Reference: C106; CLASS: DISCRETE; FPLIST: CC0201,CC0201_HD,0201_CC,cc_0201_cir; CAD_APPROVED: Yes; MFG_PN01: CL03A105MP3NSNC; MFG_NAME01: SAMSUNG; Tolerance: 10%; Temp Range: -55¡ãC to 85¡ãC; Value: 1uF; Package Type: SMD/SMT; Package Size: 0201 (0603 Metric); HEIGHT: 0.35MM; ROHS: Yes; PCB Footprint: C0201
C107 = CAP_NP: 0201,1uF,10V,+/-20%,X5R; Part Reference: C107; CLASS: DISCRETE; Temp Range: -55¡ãC to 85¡ãC; Tolerance: 10%; MFG_NAME01: SAMSUNG; MFG_PN01: CL03A105MP3NSNC; CAD_APPROVED: Yes; FPLIST: CC0201,CC0201_HD,0201_CC,cc_0201_cir; Value: 1uF; ROHS: Yes; HEIGHT: 0.35MM; Package Size: 0201 (0603 Metric); Package Type: SMD/SMT; PCB Footprint: C0201
C108 = CAP_NP: 0402,10uF,6.3V,+/-20%,X5R; Part Reference: C108; CLASS: DISCRETE; Tolerance: 20%; MFG_NAME01: FENGHUA; MFG_PN01: 0402X106M6R3NT; CAD_APPROVED: Yes; FPLIST: CC0402_25,CC0402_HD,0402_CC; Value: 10uF; ROHS: Yes; HEIGHT: 0.65 MM; PCB Footprint: C0402
C109 = CAP_NP: 0201,1uF,10V,+/-20%,X5R; Part Reference: C109; CLASS: DISCRETE; Tolerance: 10%; MFG_NAME01: SAMSUNG; MFG_PN01: CL03A105MP3NSNC; CAD_APPROVED: Yes; FPLIST: CC0201,CC0201_HD,0201_CC,cc_0201_cir; Temp Range: -55¡ãC to 85¡ãC; Value: 1uF; ROHS: Yes; HEIGHT: 0.35MM; Package Size: 0201 (0603 Metric); Package Type: SMD/SMT; PCB Footprint: C0201
C110 = CAP_NP: 0201,1uF,10V,+/-20%,X5R; Part Reference: C110; CLASS: DISCRETE; Tolerance: 10%; MFG_NAME01: SAMSUNG; MFG_PN01: CL03A105MP3NSNC; CAD_APPROVED: Yes; FPLIST: CC0201,CC0201_HD,0201_CC,cc_0201_cir; Temp Range: -55¡ãC to 85¡ãC; Value: 1uF; ROHS: Yes; HEIGHT: 0.35MM; Package Size: 0201 (0603 Metric); Package Type: SMD/SMT; PCB Footprint: C0201
C111 = CAP_NP: 0201,1uF,10V,+/-20%,X5R; Part Reference: C111; CLASS: DISCRETE; Tolerance: 10%; MFG_NAME01: SAMSUNG; MFG_PN01: CL03A105MP3NSNC; CAD_APPROVED: Yes; FPLIST: CC0201,CC0201_HD,0201_CC,cc_0201_cir; Temp Range: -55¡ãC to 85¡ãC; Value: 1uF; ROHS: Yes; HEIGHT: 0.35MM; Package Size: 0201 (0603 Metric); Package Type: SMD/SMT; PCB Footprint: C0201
C114 = CAP_NP: 0201,1uF,10V,+/-20%,X5R; Part Reference: C114; CLASS: DISCRETE; Temp Range: -55¡ãC to 85¡ãC; FPLIST: CC0201,CC0201_HD,0201_CC,cc_0201_cir; CAD_APPROVED: Yes; MFG_PN01: CL03A105MP3NSNC; MFG_NAME01: SAMSUNG; Tolerance: 10%; Value: 1uF; Package Type: SMD/SMT; Package Size: 0201 (0603 Metric); HEIGHT: 0.35MM; ROHS: Yes; PCB Footprint: C0201
C116 = CAP_NP: 0201,1uF,10V,+/-20%,X5R; Part Reference: C116; CLASS: DISCRETE; Temp Range: -55¡ãC to 85¡ãC; FPLIST: CC0201,CC0201_HD,0201_CC,cc_0201_cir; CAD_APPROVED: Yes; MFG_PN01: CL03A105MP3NSNC; MFG_NAME01: SAMSUNG; Tolerance: 10%; Value: 1uF; HEIGHT: 0.35MM; ROHS: Yes; Package Size: 0201 (0603 Metric); Package Type: SMD/SMT; PCB Footprint: C0201
C117 = CAP_NP: 0201,1uF,10V,+/-20%,X5R; Part Reference: C117; CLASS: DISCRETE; Temp Range: -55¡ãC to 85¡ãC; FPLIST: CC0201,CC0201_HD,0201_CC,cc_0201_cir; CAD_APPROVED: Yes; MFG_PN01: CL03A105MP3NSNC; MFG_NAME01: SAMSUNG; Tolerance: 10%; Value: 1uF; HEIGHT: 0.35MM; ROHS: Yes; Package Size: 0201 (0603 Metric); Package Type: SMD/SMT; PCB Footprint: C0201
C118 = CAP_NP: 0201,1uF,10V,+/-20%,X5R; Part Reference: C118; CLASS: DISCRETE; Temp Range: -55¡ãC to 85¡ãC; FPLIST: CC0201,CC0201_HD,0201_CC,cc_0201_cir; CAD_APPROVED: Yes; MFG_PN01: CL03A105MP3NSNC; MFG_NAME01: SAMSUNG; Tolerance: 10%; Value: 1uF; HEIGHT: 0.35MM; ROHS: Yes; Package Size: 0201 (0603 Metric); Package Type: SMD/SMT; PCB Footprint: C0201
C119 = CAP_NP: 0201,1uF,10V,+/-20%,X5R; Part Reference: C119; CLASS: DISCRETE; Temp Range: -55¡ãC to 85¡ãC; FPLIST: CC0201,CC0201_HD,0201_CC,cc_0201_cir; CAD_APPROVED: Yes; MFG_PN01: CL03A105MP3NSNC; MFG_NAME01: SAMSUNG; Tolerance: 10%; Value: 1uF; HEIGHT: 0.35MM; ROHS: Yes; Package Size: 0201 (0603 Metric); Package Type: SMD/SMT; PCB Footprint: C0201
C124 = CAP_NP: 0402,10uF,6.3V,+/-20%,X5R; Part Reference: C124; CLASS: DISCRETE; FPLIST: CC0402_25,CC0402_HD,0402_CC; CAD_APPROVED: Yes; MFG_PN01: 0402X106M6R3NT; MFG_NAME01: FENGHUA; Tolerance: 20%; Value: 10uF; HEIGHT: 0.65 MM; ROHS: Yes; PCB Footprint: C0402
C129 = CAP_NP: 0201,1uF,10V,+/-20%,X5R; Part Reference: C129; CLASS: DISCRETE; Tolerance: 10%; MFG_NAME01: SAMSUNG; MFG_PN01: CL03A105MP3NSNC; CAD_APPROVED: Yes; FPLIST: CC0201,CC0201_HD,0201_CC,cc_0201_cir; Temp Range: -55¡ãC to 85¡ãC; Value: 1uF; Package Type: SMD/SMT; Package Size: 0201 (0603 Metric); ROHS: Yes; HEIGHT: 0.35MM; PCB Footprint: C0201
C130 = CAP_NP: 0201,1uF,10V,+/-20%,X5R; Part Reference: C130; CLASS: DISCRETE; Temp Range: -55¡ãC to 85¡ãC; Tolerance: 10%; MFG_NAME01: SAMSUNG; MFG_PN01: CL03A105MP3NSNC; CAD_APPROVED: Yes; FPLIST: CC0201,CC0201_HD,0201_CC,cc_0201_cir; Value: 1uF; ROHS: Yes; HEIGHT: 0.35MM; Package Size: 0201 (0603 Metric); Package Type: SMD/SMT; PCB Footprint: C0201
C131 = CAP_NP: 0201,1uF,10V,+/-20%,X5R; Part Reference: C131; CLASS: DISCRETE; FPLIST: CC0201,CC0201_HD,0201_CC,cc_0201_cir; CAD_APPROVED: Yes; MFG_PN01: CL03A105MP3NSNC; MFG_NAME01: SAMSUNG; Tolerance: 10%; Temp Range: -55¡ãC to 85¡ãC; Value: 1uF; Package Type: SMD/SMT; Package Size: 0201 (0603 Metric); HEIGHT: 0.35MM; ROHS: Yes; PCB Footprint: C0201
C132 = CAP_NP: 0201,1uF,10V,+/-20%,X5R; Part Reference: C132; CLASS: DISCRETE; FPLIST: CC0201,CC0201_HD,0201_CC,cc_0201_cir; CAD_APPROVED: Yes; MFG_PN01: CL03A105MP3NSNC; MFG_NAME01: SAMSUNG; Tolerance: 10%; Temp Range: -55¡ãC to 85¡ãC; Value: 1uF; Package Type: SMD/SMT; Package Size: 0201 (0603 Metric); HEIGHT: 0.35MM; ROHS: Yes; PCB Footprint: C0201
C134 = CAP_NP: 0201,1uF,10V,+/-20%,X5R; Part Reference: C134; CLASS: DISCRETE; Temp Range: -55¡ãC to 85¡ãC; Tolerance: 10%; MFG_NAME01: SAMSUNG; MFG_PN01: CL03A105MP3NSNC; CAD_APPROVED: Yes; FPLIST: CC0201,CC0201_HD,0201_CC,cc_0201_cir; Value: 1uF; ROHS: Yes; HEIGHT: 0.35MM; Package Size: 0201 (0603 Metric); Package Type: SMD/SMT; PCB Footprint: C0201
C135 = CAP_NP: 0201,1uF,10V,+/-20%,X5R; Part Reference: C135; CLASS: DISCRETE; Temp Range: -55¡ãC to 85¡ãC; Tolerance: 10%; MFG_NAME01: SAMSUNG; MFG_PN01: CL03A105MP3NSNC; CAD_APPROVED: Yes; FPLIST: CC0201,CC0201_HD,0201_CC,cc_0201_cir; Value: 1uF; ROHS: Yes; HEIGHT: 0.35MM; Package Size: 0201 (0603 Metric); Package Type: SMD/SMT; PCB Footprint: C0201
C136 = CAP_NP: 0402,10uF,6.3V,+/-20%,X5R; Part Reference: C136; CLASS: DISCRETE; Tolerance: 20%; MFG_NAME01: FENGHUA; MFG_PN01: 0402X106M6R3NT; CAD_APPROVED: Yes; FPLIST: CC0402_25,CC0402_HD,0402_CC; Value: 10uF; ROHS: Yes; HEIGHT: 0.65 MM; PCB Footprint: C0402
C137 = CAP_NP: 0201,1uF,10V,+/-20%,X5R; Part Reference: C137; CLASS: DISCRETE; Tolerance: 10%; MFG_NAME01: SAMSUNG; MFG_PN01: CL03A105MP3NSNC; CAD_APPROVED: Yes; FPLIST: CC0201,CC0201_HD,0201_CC,cc_0201_cir; Temp Range: -55¡ãC to 85¡ãC; Value: 1uF; Package Type: SMD/SMT; Package Size: 0201 (0603 Metric); ROHS: Yes; HEIGHT: 0.35MM; PCB Footprint: C0201
C138 = CAP_NP: 0201,1uF,10V,+/-20%,X5R; Part Reference: C138; CLASS: DISCRETE; Tolerance: 10%; MFG_NAME01: SAMSUNG; MFG_PN01: CL03A105MP3NSNC; CAD_APPROVED: Yes; FPLIST: CC0201,CC0201_HD,0201_CC,cc_0201_cir; Temp Range: -55¡ãC to 85¡ãC; Value: 1uF; Package Type: SMD/SMT; Package Size: 0201 (0603 Metric); ROHS: Yes; HEIGHT: 0.35MM; PCB Footprint: C0201
C139 = CAP_NP: 0201,1uF,10V,+/-20%,X5R; Part Reference: C139; CLASS: DISCRETE; Tolerance: 10%; MFG_NAME01: SAMSUNG; MFG_PN01: CL03A105MP3NSNC; CAD_APPROVED: Yes; FPLIST: CC0201,CC0201_HD,0201_CC,cc_0201_cir; Temp Range: -55¡ãC to 85¡ãC; Value: 1uF; Package Type: SMD/SMT; Package Size: 0201 (0603 Metric); ROHS: Yes; HEIGHT: 0.35MM; PCB Footprint: C0201
C140 = CAP_NP: 0201,1uF,10V,+/-20%,X5R; Part Reference: C140; CLASS: DISCRETE; Tolerance: 10%; MFG_NAME01: SAMSUNG; MFG_PN01: CL03A105MP3NSNC; CAD_APPROVED: Yes; FPLIST: CC0201,CC0201_HD,0201_CC,cc_0201_cir; Temp Range: -55¡ãC to 85¡ãC; Value: 1uF; Package Type: SMD/SMT; Package Size: 0201 (0603 Metric); ROHS: Yes; HEIGHT: 0.35MM; PCB Footprint: C0201
C141 = CAP_NP: 0201,1uF,10V,+/-20%,X5R; Part Reference: C141; CLASS: DISCRETE; Tolerance: 10%; MFG_NAME01: SAMSUNG; MFG_PN01: CL03A105MP3NSNC; CAD_APPROVED: Yes; FPLIST: CC0201,CC0201_HD,0201_CC,cc_0201_cir; Temp Range: -55¡ãC to 85¡ãC; Value: 1uF; Package Type: SMD/SMT; Package Size: 0201 (0603 Metric); ROHS: Yes; HEIGHT: 0.35MM; PCB Footprint: C0201
C142 = CAP_NP: 0603,22uF,6.3V,+/-20%,X5R; Part Reference: C142; CLASS: DISCRETE; FPLIST: CC0603_OV,CC0603,0603_cc_tol; CAD_APPROVED: Yes; MFG_PN01: CL10A226MQ8NRNC; MFG_NAME01: SAMSUNG; Tolerance: 20%; SIGNAL_MODEL: DEFAULT_CAPACITOR_2.2e+07pF_2_1; Value: 22uF; HEIGHT: 1MM; ROHS: Yes; WVDC: 6.3V; Package Size: 0603; PCB Footprint: C0603
C143 = CAP_NP: 0603,22uF,6.3V,+/-20%,X5R; Part Reference: C143; CLASS: DISCRETE; SIGNAL_MODEL: DEFAULT_CAPACITOR_2.2e+07pF_2_1; Tolerance: 20%; MFG_NAME01: SAMSUNG; MFG_PN01: CL10A226MQ8NRNC; CAD_APPROVED: Yes; FPLIST: CC0603_OV,CC0603,0603_cc_tol; Value: 22uF; Package Size: 0603; WVDC: 6.3V; ROHS: Yes; HEIGHT: 1MM; PCB Footprint: C0603
C144 = CAP_NP: 0201,1uF,10V,+/-20%,X5R; Part Reference: C144; CLASS: DISCRETE; Tolerance: 10%; MFG_NAME01: SAMSUNG; MFG_PN01: CL03A105MP3NSNC; CAD_APPROVED: Yes; FPLIST: CC0201,CC0201_HD,0201_CC,cc_0201_cir; Temp Range: -55¡ãC to 85¡ãC; Value: 1uF; ROHS: Yes; HEIGHT: 0.35MM; Package Size: 0201 (0603 Metric); Package Type: SMD/SMT; PCB Footprint: C0201
C145 = CAP_NP: 0201,1uF,10V,+/-20%,X5R; Part Reference: C145; CLASS: DISCRETE; FPLIST: CC0201,CC0201_HD,0201_CC,cc_0201_cir; CAD_APPROVED: Yes; MFG_PN01: CL03A105MP3NSNC; MFG_NAME01: SAMSUNG; Tolerance: 10%; Temp Range: -55¡ãC to 85¡ãC; Value: 1uF; Package Type: SMD/SMT; Package Size: 0201 (0603 Metric); HEIGHT: 0.35MM; ROHS: Yes; PCB Footprint: C0201
C146 = CAP_NP: 0201,1uF,10V,+/-20%,X5R; Part Reference: C146; CLASS: DISCRETE; FPLIST: CC0201,CC0201_HD,0201_CC,cc_0201_cir; CAD_APPROVED: Yes; MFG_PN01: CL03A105MP3NSNC; MFG_NAME01: SAMSUNG; Tolerance: 10%; Temp Range: -55¡ãC to 85¡ãC; Value: 1uF; Package Type: SMD/SMT; Package Size: 0201 (0603 Metric); HEIGHT: 0.35MM; ROHS: Yes; PCB Footprint: C0201
C147 = CAP_NP: 0201,1uF,10V,+/-20%,X5R; Part Reference: C147; CLASS: DISCRETE; Tolerance: 10%; MFG_NAME01: SAMSUNG; MFG_PN01: CL03A105MP3NSNC; CAD_APPROVED: Yes; FPLIST: CC0201,CC0201_HD,0201_CC,cc_0201_cir; Temp Range: -55¡ãC to 85¡ãC; Value: 1uF; ROHS: Yes; HEIGHT: 0.35MM; Package Size: 0201 (0603 Metric); Package Type: SMD/SMT; PCB Footprint: C0201
C148 = CAP_NP: 0201,1uF,10V,+/-20%,X5R; Part Reference: C148; CLASS: DISCRETE; FPLIST: CC0201,CC0201_HD,0201_CC,cc_0201_cir; CAD_APPROVED: Yes; MFG_PN01: CL03A105MP3NSNC; MFG_NAME01: SAMSUNG; Tolerance: 10%; Temp Range: -55¡ãC to 85¡ãC; Value: 1uF; Package Type: SMD/SMT; Package Size: 0201 (0603 Metric); HEIGHT: 0.35MM; ROHS: Yes; PCB Footprint: C0201
C149 = CAP_NP: 0201,1uF,10V,+/-20%,X5R; Part Reference: C149; CLASS: DISCRETE; Temp Range: -55¡ãC to 85¡ãC; Tolerance: 10%; MFG_NAME01: SAMSUNG; MFG_PN01: CL03A105MP3NSNC; CAD_APPROVED: Yes; FPLIST: CC0201,CC0201_HD,0201_CC,cc_0201_cir; Value: 1uF; ROHS: Yes; HEIGHT: 0.35MM; Package Size: 0201 (0603 Metric); Package Type: SMD/SMT; PCB Footprint: C0201
C151 = CAP_NP: 0402,10uF,6.3V,+/-20%,X5R; Part Reference: C151; CLASS: DISCRETE; FPLIST: CC0402_25,CC0402_HD,0402_CC; CAD_APPROVED: Yes; MFG_PN01: 0402X106M6R3NT; MFG_NAME01: FENGHUA; Tolerance: 20%; Value: 10uF; HEIGHT: 0.65 MM; ROHS: Yes; PCB Footprint: C0402
C152 = CAP_NP: 0201,1uF,10V,+/-20%,X5R; Part Reference: C152; CLASS: DISCRETE; Temp Range: -55¡ãC to 85¡ãC; Tolerance: 10%; MFG_NAME01: SAMSUNG; MFG_PN01: CL03A105MP3NSNC; CAD_APPROVED: Yes; FPLIST: CC0201,CC0201_HD,0201_CC,cc_0201_cir; Value: 1uF; Package Type: SMD/SMT; Package Size: 0201 (0603 Metric); ROHS: Yes; HEIGHT: 0.35MM; PCB Footprint: C0201
C153 = CAP_NP: 0201,1uF,10V,+/-20%,X5R; Part Reference: C153; CLASS: DISCRETE; FPLIST: CC0201,CC0201_HD,0201_CC,cc_0201_cir; CAD_APPROVED: Yes; MFG_PN01: CL03A105MP3NSNC; MFG_NAME01: SAMSUNG; Tolerance: 10%; Temp Range: -55¡ãC to 85¡ãC; Value: 1uF; HEIGHT: 0.35MM; ROHS: Yes; Package Size: 0201 (0603 Metric); Package Type: SMD/SMT; PCB Footprint: C0201
C154 = CAP_NP: 0201,1uF,10V,+/-20%,X5R; Part Reference: C154; CLASS: DISCRETE; FPLIST: CC0201,CC0201_HD,0201_CC,cc_0201_cir; CAD_APPROVED: Yes; MFG_PN01: CL03A105MP3NSNC; MFG_NAME01: SAMSUNG; Tolerance: 10%; Temp Range: -55¡ãC to 85¡ãC; Value: 1uF; HEIGHT: 0.35MM; ROHS: Yes; Package Size: 0201 (0603 Metric); Package Type: SMD/SMT; PCB Footprint: C0201
C155 = CAP_NP: 0201,1uF,10V,+/-20%,X5R; Part Reference: C155; CLASS: DISCRETE; Tolerance: 10%; MFG_NAME01: SAMSUNG; MFG_PN01: CL03A105MP3NSNC; CAD_APPROVED: Yes; FPLIST: CC0201,CC0201_HD,0201_CC,cc_0201_cir; Temp Range: -55¡ãC to 85¡ãC; Value: 1uF; ROHS: Yes; HEIGHT: 0.35MM; Package Size: 0201 (0603 Metric); Package Type: SMD/SMT; PCB Footprint: C0201
C156 = CAP_NP: 0201,1uF,10V,+/-20%,X5R; Part Reference: C156; CLASS: DISCRETE; Temp Range: -55¡ãC to 85¡ãC; FPLIST: CC0201,CC0201_HD,0201_CC,cc_0201_cir; CAD_APPROVED: Yes; MFG_PN01: CL03A105MP3NSNC; MFG_NAME01: SAMSUNG; Tolerance: 10%; Value: 1uF; HEIGHT: 0.35MM; ROHS: Yes; Package Size: 0201 (0603 Metric); Package Type: SMD/SMT; PCB Footprint: C0201
FB16 = FB0402,120ohm,1.3A: 0603,1000Ohm@100MHz,800mA; Part Reference: FB16; serial number: 1110304038; MFG_NAME01: Sunlord; MFG_PN01: PZ1608D102-R80TF; PCB Footprint: FB0603; Value: 1000Ohm
R111 = RES: 0603,0Ohm,+/-5%; Part Reference: R111; CLASS: DISCRETE; Temp Range: ¨C55 ¡ãC to +155 ¡ãC; FPLIST: RC0603_OV,RC0603,R603-X2,0603_CC,IND_0603HP_NSP,CC0603_OV_NSP; CAD_APPROVED: Yes; MFG_PN01: RS-03000JT; MFG_NAME01: FENGHUA; Value: 0R; HEIGHT: 0.6MM; ROHS: Yes; PCB Footprint: R0603
U101 = MIMX9352DVNxLAA: MIMX9352CVVXMAB,-40~105+C,11*11mm,0.5mm pitch,FCBGA,A,306pin,1.7GHz; Part Reference: U101; CLASS: IC; MFG_NAME01: NXP SEMICONDUCTORS; CAD_APPROVED: Yes; FPLIST: skt_bga306_0p5_sq16p23_elast,skt_bga306_0p5_sq16p23_elast_nsp; Value: SKT BGA 306 + MIMX9352DVNxLAA; MFG_PN01: MIMX9352DVNxLAA; ROHS: Yes; HEIGHT: 10.03MM; PCB Footprint: skt_bga306_0p5_sq16p23_elast_nsp